# EAGLE design Emech_DevBoard_v2.0 (EAGLE 9.0.1)

## Sheet 1 of 2
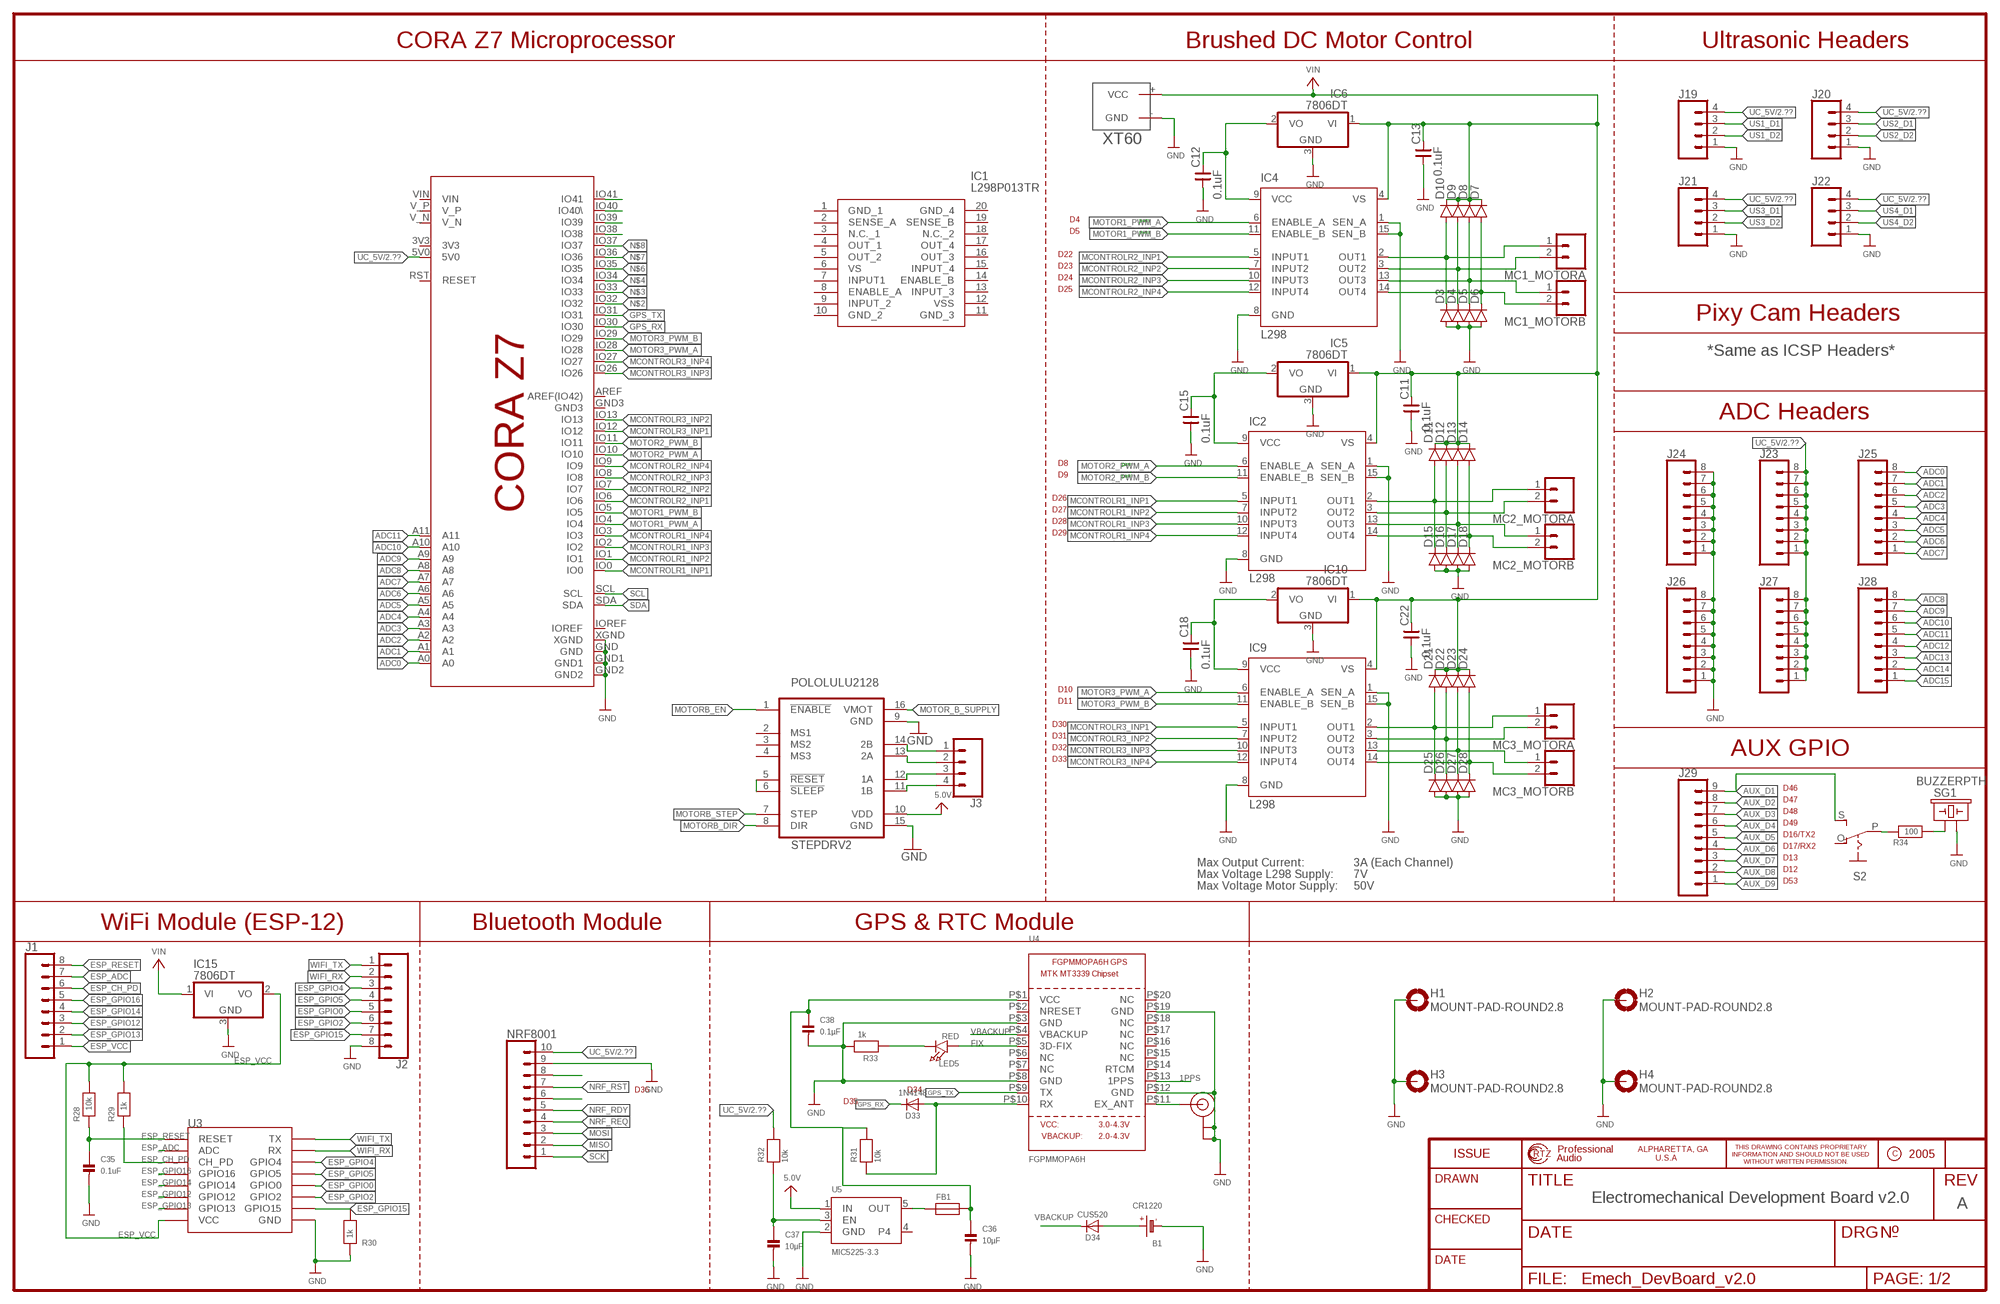
[diagram p0: schematic, sheet 1]

### Parts
B1  CR1220  BATTERYCR1220_SMT  [CR1220]
C11  0.1uF  CNP-0603  [0603]
C12  0.1uF  CNP-0603  [0603]
C13  0.1uF  CNP-0603  [0603]
C15  0.1uF  CNP-0603  [0603]
C18  0.1uF  CNP-0603  [0603]
C22  0.1uF  CNP-0603  [0603]
C35  0.1uF  CAP_CERAMIC0805  [0805]
C36  10µF  CAP_CERAMIC0603  [0603]
C37  10µF  CAP_CERAMIC0603  [0603]
C38  0.1µF  CAP_CERAMIC0603  [0603]
D3  SS24FSCT-ND  DIODEDO214AA  [DO-214AA]
D4  SS24FSCT-ND  DIODEDO214AA  [DO-214AA]
D5  SS24FSCT-ND  DIODEDO214AA  [DO-214AA]
D6  SS24FSCT-ND  DIODEDO214AA  [DO-214AA]
D7  SS24FSCT-ND  DIODEDO214AA  [DO-214AA]
D8  SS24FSCT-ND  DIODEDO214AA  [DO-214AA]
D9  SS24FSCT-ND  DIODEDO214AA  [DO-214AA]
D10  SS24FSCT-ND  DIODEDO214AA  [DO-214AA]
D11  SS24FSCT-ND  DIODEDO214AA  [DO-214AA]
D12  SS24FSCT-ND  DIODEDO214AA  [DO-214AA]
D13  SS24FSCT-ND  DIODEDO214AA  [DO-214AA]
D14  SS24FSCT-ND  DIODEDO214AA  [DO-214AA]
D15  SS24FSCT-ND  DIODEDO214AA  [DO-214AA]
D16  SS24FSCT-ND  DIODEDO214AA  [DO-214AA]
D17  SS24FSCT-ND  DIODEDO214AA  [DO-214AA]
D18  SS24FSCT-ND  DIODEDO214AA  [DO-214AA]
D21  SS24FSCT-ND  DIODEDO214AA  [DO-214AA]
D22  SS24FSCT-ND  DIODEDO214AA  [DO-214AA]
D23  SS24FSCT-ND  DIODEDO214AA  [DO-214AA]
D24  SS24FSCT-ND  DIODEDO214AA  [DO-214AA]
D25  SS24FSCT-ND  DIODEDO214AA  [DO-214AA]
D26  SS24FSCT-ND  DIODEDO214AA  [DO-214AA]
D27  SS24FSCT-ND  DIODEDO214AA  [DO-214AA]
D28  SS24FSCT-ND  DIODEDO214AA  [DO-214AA]
D33  1N4148  DIODESOD-323  [SOD-323]
D34  CUS520  DIODESOD-323  [SOD-323]
FB1  FERRITE  [0603]
H1  MOUNT-PAD-ROUND2.8  [2,8-PAD]
H2  MOUNT-PAD-ROUND2.8  [2,8-PAD]
H3  MOUNT-PAD-ROUND2.8  [2,8-PAD]
H4  MOUNT-PAD-ROUND2.8  [2,8-PAD]
IC1  L298P013TR  [SOIC127P1420X360-20N]
IC2  L298  [MULTIWATT-15]
IC4  L298  [MULTIWATT-15]
IC5  7806DT  [TO252]
IC6  7806DT  [TO252]
IC9  L298  [MULTIWATT-15]
IC10  7806DT  [TO252]
IC15  7806DT  [TO252]
J1  CONN_08"  [1X08]
J2  CONN_08"  [1X08]
J3  CONN_04JST-PTH-VERT  [JST-4-PTH-VERT]
J19  CONN_04  [1X04]
J20  CONN_04  [1X04]
J21  CONN_04  [1X04]
J22  CONN_04  [1X04]
J23  CONN_08"  [1X08]
J24  CONN_08"  [1X08]
J25  CONN_08"  [1X08]
J26  CONN_08"  [1X08]
J27  CONN_08"  [1X08]
J28  CONN_08"  [1X08]
J29  CONN_09  [1X09]
LED5  RED  LED0805  [CHIPLED_0805]
MC1_MOTORA  CONN_025MM  [SCREWTERMINAL-5MM-2]
MC1_MOTORB  CONN_025MM  [SCREWTERMINAL-5MM-2]
MC2_MOTORA  CONN_025MM  [SCREWTERMINAL-5MM-2]
MC2_MOTORB  CONN_025MM  [SCREWTERMINAL-5MM-2]
MC3_MOTORA  CONN_025MM  [SCREWTERMINAL-5MM-2]
MC3_MOTORB  CONN_025MM  [SCREWTERMINAL-5MM-2]
NRF8001  CONN_10"  [1X10]
R28  10k  RESISTOR0805  [0805]
R29  1k  RESISTOR0805  [0805]
R30  1k  RESISTOR0805  [0805]
R31  10k  RESISTOR0603  [0603]
R32  10k  RESISTOR0603  [0603]
R33  1k  RESISTOR0603  [0603]
R34  100  RESISTOR0805  [0805]
S2  EG1218S  [EG1218]
SG1  BUZZERPTH  [BUZZER-12MM]
STEPDRV2  POLOLULU2128  [POLOLULU2128]
U3  ESP12  [ESP12]
U4  FGPMMOPA6H  GPS_FGPMMOPA6H  [FGPMMOPA6H]
U5  MIC5225-3.3  VREG_SOT23-5  [SOT23-5]
U$1  CORA_Z7  [CORA_Z7_SHIELD]
U$14  XT60  [XT60]
U$55  U.FL  [U.FL]

### Nets
1PPS: U4.P$13(1PPS)
5.0V: STEPDRV2.10(VDD) U5.1(IN)
ADC0: J25.8 U$1.A0
ADC1: J25.7 U$1.A1
ADC2: J25.6 U$1.A2
ADC3: J25.5 U$1.A3
ADC4: J25.4 U$1.A4
ADC5: J25.3 U$1.A5
ADC6: J25.2 U$1.A6
ADC7: J25.1 U$1.A7
ADC8: J28.8 U$1.A8
ADC9: J28.7 U$1.A9
ADC10: J28.6 U$1.A10
ADC11: J28.5 U$1.A11
ADC12: J28.4
ADC13: J28.3
ADC14: J28.2
ADC15: J28.1
AUX_D1: J29.9 S2.S
AUX_D2: J29.8
AUX_D3: J29.7
AUX_D4: J29.6
AUX_D5: J29.5
AUX_D6: J29.4
AUX_D7: J29.3
AUX_D8: J29.2
AUX_D9: J29.1
D9: NRF8001.6
ESP_ADC: J1.7 U3.ADC
ESP_CH_PD: J1.6 R29.1 U3.CH_PD
ESP_GPIO0: J2.5 U3.GPIO0
ESP_GPIO2: J2.6 U3.GPIO2
ESP_GPIO4: J2.3 U3.GPIO4
ESP_GPIO5: J2.4 U3.GPIO5
ESP_GPIO12: J1.3 U3.GPIO12
ESP_GPIO13: J1.2 U3.GPIO13
ESP_GPIO14: J1.4 U3.GPIO14
ESP_GPIO15: J2.7 R30.2 U3.GPIO15
ESP_GPIO16: J1.5 U3.GPIO16
ESP_RESET: C35.1 J1.8 R28.1 U3.RESET
ESP_VCC: IC15.2(VO) J1.1 R28.2 R29.2 U3.VCC
FIX: LED5.A U4.P$5(3D-FIX)
GND [32mil]: B1.- C11.1 C12.1 C13.1 C15.1 C18.1 C22.1 C35.2 C36.2 C37.2 C38.2 D3.A D4.A D5.A D6.A D15.A D16.A D17.A D18.A D25.A D26.A D27.A D28.A H1.B2,8(MOUNT) H2.B2,8(MOUNT) H3.B2,8(MOUNT) H4.B2,8(MOUNT) IC2.1(SEN_A) IC2.8(GND) IC2.15(SEN_B) IC4.1(SEN_A) IC4.8(GND) IC4.15(SEN_B) IC5.3(GND) IC6.3(GND) IC9.1(SEN_A) IC9.8(GND) IC9.15(SEN_B) IC10.3(GND) IC15.3(GND) J2.8 J19.1 J20.1 J21.1 J22.1 J24.1 J24.2 J24.3 J24.4 J24.5 J24.6 J24.7 J24.8 J26.1 J26.2 J26.3 J26.4 J26.5 J26.6 J26.7 J26.8 NRF8001.9 R30.1 R33.2 SG1.- STEPDRV2.9(GND) STEPDRV2.15(GND) U3.GND U4.P$3(GND) U4.P$8(GND) U4.P$12(GND) U4.P$19(GND) U5.2(GND) U$1.GND U$1.GND1 U$1.GND2 U$1.XGND U$14.-(GND) U$55.P$1(GND) U$55.P$2(GND) ; also sheet 2
GPS_RX: D33.C U$1.IO30
GPS_TX: U4.P$9(TX) U$1.IO31
MCONTROLR1_INP1: IC2.5(INPUT1) U$1.IO0
MCONTROLR1_INP2: IC2.7(INPUT2) U$1.IO1
MCONTROLR1_INP3: IC2.10(INPUT3) U$1.IO2
MCONTROLR1_INP4: IC2.12(INPUT4) U$1.IO3
MCONTROLR2_INP1: IC4.5(INPUT1) U$1.IO6
MCONTROLR2_INP2: IC4.7(INPUT2) U$1.IO7
MCONTROLR2_INP3: IC4.10(INPUT3) U$1.IO8
MCONTROLR2_INP4: IC4.12(INPUT4) U$1.IO9
MCONTROLR3_INP1: IC9.5(INPUT1) U$1.IO12
MCONTROLR3_INP2: IC9.7(INPUT2) U$1.IO13
MCONTROLR3_INP3: IC9.10(INPUT3) U$1.IO26
MCONTROLR3_INP4: IC9.12(INPUT4) U$1.IO27
MISO: NRF8001.2
MOSI: NRF8001.3
MOTOR1_PWM_A: IC4.6(ENABLE_A) U$1.IO4
MOTOR1_PWM_B: IC4.11(ENABLE_B) U$1.IO5
MOTOR2_PWM_A: IC2.6(ENABLE_A) U$1.IO10
MOTOR2_PWM_B: IC2.11(ENABLE_B) U$1.IO11
MOTOR3_PWM_A: IC9.6(ENABLE_A) U$1.IO28
MOTOR3_PWM_B: IC9.11(ENABLE_B) U$1.IO29
MOTOR_B_SUPPLY: STEPDRV2.16(VMOT)
MOTORB_DIR: STEPDRV2.8(DIR)
MOTORB_EN: STEPDRV2.1(!ENABLE)
MOTORB_STEP: STEPDRV2.7(STEP)
N$1: J3.1 STEPDRV2.14(2B)
N$2: U$1.IO32
N$3: U$1.IO33
N$4: U$1.IO34
N$5: J3.2 STEPDRV2.13(2A)
N$6: U$1.IO35
N$7: U$1.IO36
N$8: U$1.IO37
N$9: U$1.IO38
N$10: U$1.IO39
N$11: U$1.IO40(IO40\)
N$12: U$1.IO41
N$13: J3.3 STEPDRV2.12(1A)
N$14: J3.4 STEPDRV2.11(1B)
N$15: C12.2 IC4.9(VCC) IC6.2(VO)
N$17: C15.2 IC2.9(VCC) IC5.2(VO)
N$18: STEPDRV2.5(!RESET) STEPDRV2.6(!SLEEP)
N$33: D3.C D10.A IC4.2(OUT1) MC1_MOTORA.1
N$34: D4.C D9.A IC4.3(OUT2) MC1_MOTORA.2
N$35: D5.C D8.A IC4.13(OUT3) MC1_MOTORB.1
N$36: D6.C D7.A IC4.14(OUT4) MC1_MOTORB.2
N$38: D21.A D25.C IC9.2(OUT1) MC3_MOTORA.1
N$39: D22.A D26.C IC9.3(OUT2) MC3_MOTORA.2
N$40: D23.A D27.C IC9.13(OUT3) MC3_MOTORB.1
N$41: D24.A D28.C IC9.14(OUT4) MC3_MOTORB.2
N$42: C18.2 IC9.9(VCC) IC10.2(VO)
N$46: D11.A D15.C IC2.2(OUT1) MC2_MOTORA.1
N$47: D12.A D16.C IC2.3(OUT2) MC2_MOTORA.2
N$48: D13.A D17.C IC2.13(OUT3) MC2_MOTORB.1
N$49: D14.A D18.C IC2.14(OUT4) MC2_MOTORB.2
N$73: U4.P$11(EX_ANT) U$55.P$3(SIGNAL)
N$75: D33.A R31.1 U4.P$10(RX)
N$76: NRF8001.8
N$77: C36.1 C38.1 FB1.2 R31.2 U4.P$1(VCC)
N$78: C37.1 R32.1 U5.3(EN)
N$79: LED5.C R33.1
N$80: B1.+$1(+) B1.+$2(+) D34.A
N$81: R34.2 S2.P
N$82: R34.1 SG1.+
NRF_RDY: NRF8001.5
NRF_REQ: NRF8001.4
NRF_RST: NRF8001.7
OUT: FB1.1 U5.5(OUT)
SCK: NRF8001.1
SCL: U$1.SCL ; also sheet 2
SDA: U$1.SDA ; also sheet 2
UC_5V [16mil]: J19.4 J20.4 J21.4 J22.4 J23.1 J23.2 J23.3 J23.4 J23.5 J23.6 J23.7 J23.8 J27.1 J27.2 J27.3 J27.4 J27.5 J27.6 J27.7 J27.8 NRF8001.10 R32.2 U$1.5V0 ; also sheet 2
US1_D1: J19.3
US1_D2: J19.2
US2_D1: J20.3
US2_D2: J20.2
US3_D1: J21.3
US3_D2: J21.2
US4_D1: J22.3
US4_D2: J22.2
VBACKUP: D34.C U4.P$4(VBACKUP)
VIN [24mil]: C11.2 C13.2 C22.2 D7.C D8.C D9.C D10.C D11.C D12.C D13.C D14.C D21.C D22.C D23.C D24.C IC2.4(VS) IC4.4(VS) IC5.1(VI) IC6.1(VI) IC9.4(VS) IC10.1(VI) IC15.1(VI) U$14.+(VCC) ; also sheet 2
WIFI_RX: J2.2 U3.RX
WIFI_TX: J2.1 U3.TX
Unconnected: IC1.1(GND_1) IC1.2(SENSE_A) IC1.3(N.C._1) IC1.4(OUT_1) IC1.5(OUT_2) IC1.6(VS) IC1.7(INPUT1) IC1.8(ENABLE_A) IC1.9(INPUT_2) IC1.10(GND_2) IC1.11(GND_3) IC1.12(VSS) IC1.13(INPUT_3) IC1.14(ENABLE_B) IC1.15(INPUT_4) IC1.16(OUT_3) IC1.17(OUT_4) IC1.18(N.C._2) IC1.19(SENSE_B) IC1.20(GND_4) S2.O STEPDRV2.2(MS1) STEPDRV2.3(MS2) STEPDRV2.4(MS3) U4.P$2(NRESET) U4.P$6(NC) U4.P$7(NC) U4.P$14(RTCM) U4.P$15(NC) U4.P$16(NC) U4.P$17(NC) U4.P$18(NC) U4.P$20(NC) U5.4 U$1.3V3 U$1.AREF(AREF(IO42)) U$1.GND3 U$1.IOREF U$1.RST(RESET) U$1.V_N U$1.V_P U$1.VIN

### Notes on the sheet
- CORA Z7 Microprocessor | Brushed DC Motor Control | Ultrasonic Headers
- D4 | pwm
- D5 | pwm
- D22
- D23
- D24
- D25
- Pixy Cam Headers
- *Same as ICSP Headers*
- ADC Headers
- D8 | pwm
- D9 | pwm
- D26
- D27
- D28
- D29
- D10
- D11
- D30
- D31
- D32
- AUX GPIO
- D33
- D46
- D47
- D48
- D49
- D16/TX2
- D17/RX2
- D13
- Max Output Current: | 3A | (Each Channel)
- D12
- Max Voltage L298 Supply: | 7V
- D53
- Max Voltage Motor Supply: | 50V
- WiFi Module (ESP-12) | Bluetooth Module | GPS & RTC Module
- D36 | D34
- D35
- Electromechanical Development Board v2.0
- A

## Sheet 2 of 2
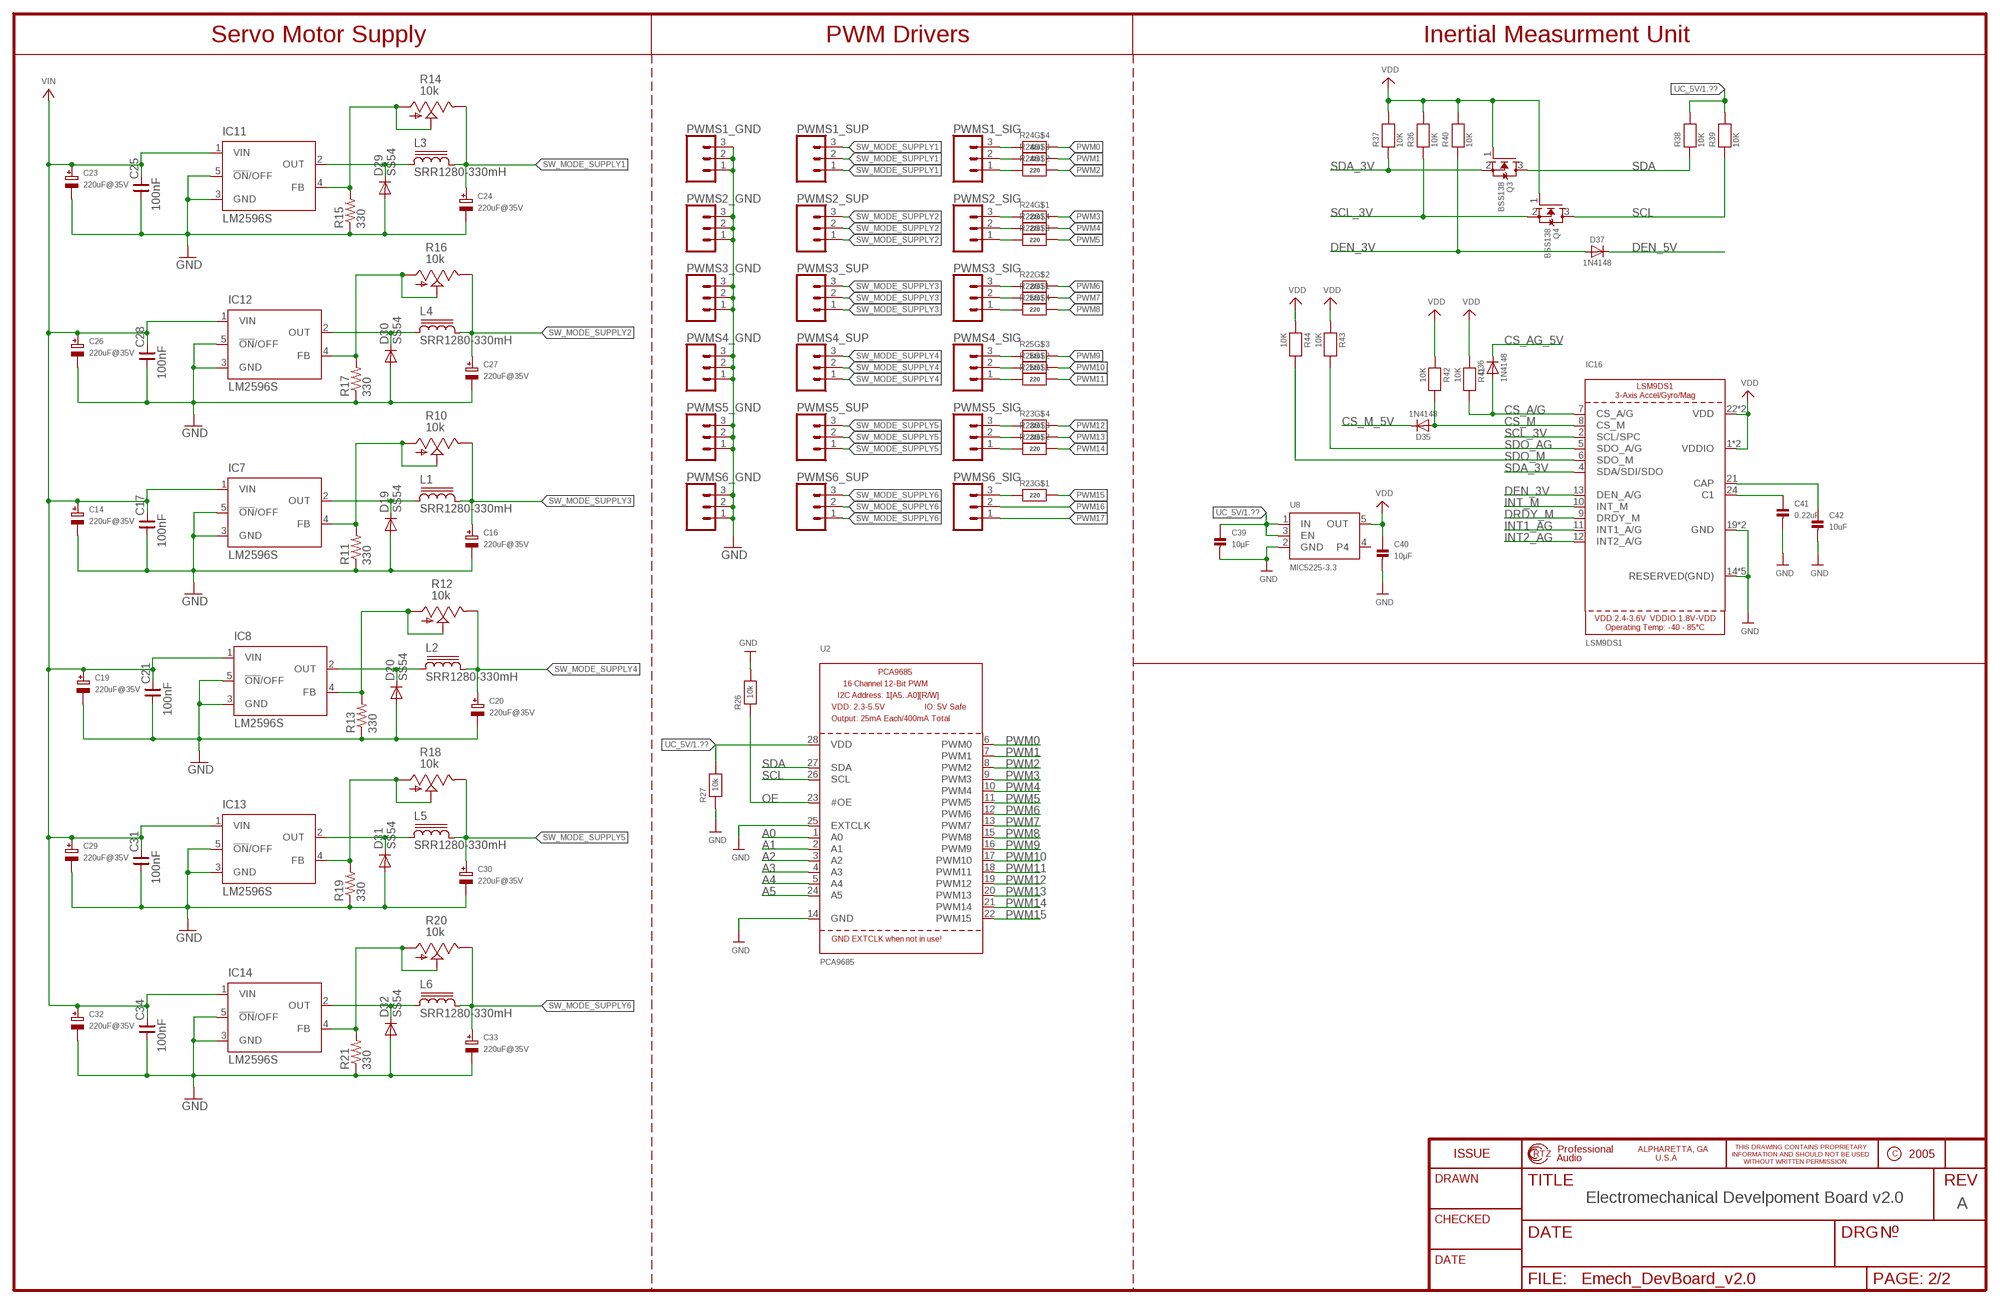
[diagram p1: schematic, sheet 2]

### Parts
C14  220uF@35V  CAP_ELECTROLYTICPANASONIC_D  [PANASONIC_D]
C16  220uF@35V  CAP_ELECTROLYTICPANASONIC_D  [PANASONIC_D]
C17  100nF  CNP-0603  [0603]
C19  220uF@35V  CAP_ELECTROLYTICPANASONIC_D  [PANASONIC_D]
C20  220uF@35V  CAP_ELECTROLYTICPANASONIC_D  [PANASONIC_D]
C21  100nF  CNP-0603  [0603]
C23  220uF@35V  CAP_ELECTROLYTICPANASONIC_D  [PANASONIC_D]
C24  220uF@35V  CAP_ELECTROLYTICPANASONIC_D  [PANASONIC_D]
C25  100nF  CNP-0603  [0603]
C26  220uF@35V  CAP_ELECTROLYTICPANASONIC_D  [PANASONIC_D]
C27  220uF@35V  CAP_ELECTROLYTICPANASONIC_D  [PANASONIC_D]
C28  100nF  CNP-0603  [0603]
C29  220uF@35V  CAP_ELECTROLYTICPANASONIC_D  [PANASONIC_D]
C30  220uF@35V  CAP_ELECTROLYTICPANASONIC_D  [PANASONIC_D]
C31  100nF  CNP-0603  [0603]
C32  220uF@35V  CAP_ELECTROLYTICPANASONIC_D  [PANASONIC_D]
C33  220uF@35V  CAP_ELECTROLYTICPANASONIC_D  [PANASONIC_D]
C34  100nF  CNP-0603  [0603]
C39  10µF  CAP_CERAMIC0603  [0603]
C40  10µF  CAP_CERAMIC0603  [0603]
C41  0.22uF  CAP_CERAMIC0603  [0603]
C42  10uF  CAP_CERAMIC0603  [0603]
D19  SS54  S3G  [DO214AB]
D20  SS54  S3G  [DO214AB]
D29  SS54  S3G  [DO214AB]
D30  SS54  S3G  [DO214AB]
D31  SS54  S3G  [DO214AB]
D32  SS54  S3G  [DO214AB]
D35  1N4148  DIODESOD-323  [SOD-323]
D36  1N4148  DIODESOD-323  [SOD-323]
D37  1N4148  DIODESOD-323  [SOD-323]
IC7  LM2596S  [TO263-5]
IC8  LM2596S  [TO263-5]
IC11  LM2596S  [TO263-5]
IC12  LM2596S  [TO263-5]
IC13  LM2596S  [TO263-5]
IC14  LM2596S  [TO263-5]
IC16  LSM9DS1  [LGA24_3.5X3.1MM]
L1  SRR1280-330mH  SRR1280  [SRR1280]
L2  SRR1280-330mH  SRR1280  [SRR1280]
L3  SRR1280-330mH  SRR1280  [SRR1280]
L4  SRR1280-330mH  SRR1280  [SRR1280]
L5  SRR1280-330mH  SRR1280  [SRR1280]
L6  SRR1280-330mH  SRR1280  [SRR1280]
PWMS1_GND  CONN_03  [1X03]
PWMS1_SIG  CONN_03  [1X03]
PWMS1_SUP  CONN_03  [1X03]
PWMS2_GND  CONN_03  [1X03]
PWMS2_SIG  CONN_03  [1X03]
PWMS2_SUP  CONN_03  [1X03]
PWMS3_GND  CONN_03  [1X03]
PWMS3_SIG  CONN_03  [1X03]
PWMS3_SUP  CONN_03  [1X03]
PWMS4_GND  CONN_03  [1X03]
PWMS4_SIG  CONN_03  [1X03]
PWMS4_SUP  CONN_03  [1X03]
PWMS5_GND  CONN_03  [1X03]
PWMS5_SIG  CONN_03  [1X03]
PWMS5_SUP  CONN_03  [1X03]
PWMS6_GND  CONN_03  [1X03]
PWMS6_SIG  CONN_03  [1X03]
PWMS6_SUP  CONN_03  [1X03]
Q3  BSS138  MOSFET-NWIDE  [SOT23-WIDE]
Q4  BSS138  MOSFET-NWIDE  [SOT23-WIDE]
R10  10k  TRIM_US-S64W  [S64W]
R11  330  R-US_R0603  [R0603]
R12  10k  TRIM_US-S64W  [S64W]
R13  330  R-US_R0603  [R0603]
R14  10k  TRIM_US-S64W  [S64W]
R15  330  R-US_R0603  [R0603]
R16  10k  TRIM_US-S64W  [S64W]
R17  330  R-US_R0603  [R0603]
R18  10k  TRIM_US-S64W  [S64W]
R19  330  R-US_R0603  [R0603]
R20  10k  TRIM_US-S64W  [S64W]
R21  330  R-US_R0603  [R0603]
R22  220  RESISTOR_4PACK  [RESPACK_4X0603]
R23  220  RESISTOR_4PACK  [RESPACK_4X0603]
R24  220  RESISTOR_4PACK  [RESPACK_4X0603]
R25  220  RESISTOR_4PACK  [RESPACK_4X0603]
R26  10k  RESISTOR0805  [0805]
R27  10k  RESISTOR0805  [0805]
R36  10K  RESISTOR0603  [0603]
R37  10K  RESISTOR0603  [0603]
R38  10K  RESISTOR0603  [0603]
R39  10K  RESISTOR0603  [0603]
R40  10K  RESISTOR0603  [0603]
R41  10K  RESISTOR0603  [0603]
R42  10K  RESISTOR0603  [0603]
R43  10K  RESISTOR0603  [0603]
R44  10K  RESISTOR0603  [0603]
U2  PCA9685  [TSSOP28]
U8  MIC5225-3.3  VREG_SOT23-5  [SOT23-5]

### Nets
A0: U2.1(A0)
A1: U2.2(A1)
A2: U2.3(A2)
A3: U2.4(A3)
A4: U2.5(A4)
A5: U2.24(A5)
C2: C41.1 IC16.24(C1)
CAP1: C42.1 IC16.21(CAP)
CS_A/G: D36.A IC16.7(CS_A/G) R41.2
CS_AG_5V: D36.C
CS_M: D35.A IC16.8(CS_M) R42.2
CS_M_5V: D35.C
DEN_3V: D37.A IC16.13(DEN_A/G) R40.1
DEN_5V: D37.C
DRDY_M: IC16.9(DRDY_M)
GND [32mil]: C14.- C16.- C17.1 C19.- C20.- C21.1 C23.- C24.- C25.1 C26.- C27.- C28.1 C29.- C30.- C31.1 C32.- C33.- C34.1 C39.2 C40.2 C41.2 C42.2 D19.A D20.A D29.A D30.A D31.A D32.A IC7.3(GND) IC7.5(!ON!/OFF) IC8.3(GND) IC8.5(!ON!/OFF) IC11.3(GND) IC11.5(!ON!/OFF) IC12.3(GND) IC12.5(!ON!/OFF) IC13.3(GND) IC13.5(!ON!/OFF) IC14.3(GND) IC14.5(!ON!/OFF) IC16.14(RESERVED(GND)) IC16.15(RESERVED(GND)) IC16.16(RESERVED(GND)) IC16.17(RESERVED(GND)) IC16.18(RESERVED(GND)) IC16.19(GND) IC16.20(GND) PWMS1_GND.1 PWMS1_GND.2 PWMS1_GND.3 PWMS2_GND.1 PWMS2_GND.2 PWMS2_GND.3 PWMS3_GND.1 PWMS3_GND.2 PWMS3_GND.3 PWMS4_GND.1 PWMS4_GND.2 PWMS4_GND.3 PWMS5_GND.1 PWMS5_GND.2 PWMS5_GND.3 PWMS6_GND.1 PWMS6_GND.2 PWMS6_GND.3 R11.1 R13.1 R15.1 R17.1 R19.1 R21.1 R26.2 R27.1 U2.14(GND) U2.25(EXTCLK) U8.2(GND) ; also sheet 1
INT1_AG: IC16.11(INT1_A/G)
INT2_AG: IC16.12(INT2_A/G)
INT_M: IC16.10(INT_M)
N$16: D19.C IC7.2(OUT) L1.1
N$27: IC7.4(FB) R10.A R10.S R11.2
N$32: D20.C IC8.2(OUT) L2.1
N$37: IC8.4(FB) R12.A R12.S R13.2
N$43: D29.C IC11.2(OUT) L3.1
N$44: IC11.4(FB) R14.A R14.S R15.2
N$45: D30.C IC12.2(OUT) L4.1
N$50: IC12.4(FB) R16.A R16.S R17.2
N$51: D31.C IC13.2(OUT) L5.1
N$52: IC13.4(FB) R18.A R18.S R19.2
N$53: D32.C IC14.2(OUT) L6.1
N$54: IC14.4(FB) R20.A R20.S R21.2
N$55: PWMS1_SIG.3 R24.4
N$57: PWMS6_SIG.3 R23.1
N$58: PWMS5_SIG.1 R23.2
N$59: PWMS5_SIG.2 R23.3
N$60: PWMS5_SIG.3 R23.4
N$61: PWMS4_SIG.1 R25.1
N$62: PWMS4_SIG.2 R25.2
N$63: PWMS4_SIG.3 R25.3
N$64: PWMS3_SIG.1 R25.4
N$65: PWMS3_SIG.2 R22.1
N$66: PWMS3_SIG.3 R22.2
N$67: PWMS2_SIG.1 R22.3
N$68: PWMS2_SIG.2 R22.4
N$69: PWMS2_SIG.3 R24.1
N$70: PWMS1_SIG.2 R24.3
N$71: PWMS1_SIG.1 R24.2
OE: R26.1 U2.23(#OE)
PWM0: R24.5 U2.6(PWM0)
PWM1: R24.6 U2.7(PWM1)
PWM2: R24.7 U2.8(PWM2)
PWM3: R24.8 U2.9(PWM3)
PWM4: R22.5 U2.10(PWM4)
PWM5: R22.6 U2.11(PWM5)
PWM6: R22.7 U2.12(PWM6)
PWM7: R22.8 U2.13(PWM7)
PWM8: R25.5 U2.15(PWM8)
PWM9: R25.6 U2.16(PWM9)
PWM10: R25.7 U2.17(PWM10)
PWM11: R25.8 U2.18(PWM11)
PWM12: R23.5 U2.19(PWM12)
PWM13: R23.6 U2.20(PWM13)
PWM14: R23.7 U2.21(PWM14)
PWM15: R23.8 U2.22(PWM15)
PWM16: PWMS6_SIG.2
PWM17: PWMS6_SIG.1
SCL: Q4.3(D) R39.1 U2.26(SCL) ; also sheet 1
SCL_3V: IC16.2(SCL/SPC) Q4.2(S) R36.1
SDA: Q3.3(D) R38.1 U2.27(SDA) ; also sheet 1
SDA_3V: IC16.4(SDA/SDI/SDO) Q3.2(S) R37.1
SDO_AG: IC16.5(SDO_A/G) R43.2
SDO_M: IC16.6(SDO_M) R44.2
SW_MODE_SUPPLY1: C24.+ L3.2 PWMS1_SUP.1 PWMS1_SUP.2 PWMS1_SUP.3 R14.E
SW_MODE_SUPPLY2: C27.+ L4.2 PWMS2_SUP.1 PWMS2_SUP.2 PWMS2_SUP.3 R16.E
SW_MODE_SUPPLY3: C16.+ L1.2 PWMS3_SUP.1 PWMS3_SUP.2 PWMS3_SUP.3 R10.E
SW_MODE_SUPPLY4: C20.+ L2.2 PWMS4_SUP.1 PWMS4_SUP.2 PWMS4_SUP.3 R12.E
SW_MODE_SUPPLY5: C30.+ L5.2 PWMS5_SUP.1 PWMS5_SUP.2 PWMS5_SUP.3 R18.E
SW_MODE_SUPPLY6: C33.+ L6.2 PWMS6_SUP.1 PWMS6_SUP.2 PWMS6_SUP.3 R20.E
UC_5V [16mil]: C39.1 R27.2 R38.2 R39.2 U2.28(VDD) U8.1(IN) U8.3(EN) ; also sheet 1
VDD: C40.1 IC16.1(VDDIO) IC16.3(VDDIO) IC16.22(VDD) IC16.23(VDD) Q3.1(G) Q4.1(G) R36.2 R37.2 R40.2 R41.1 R42.1 R43.1 R44.1 U8.5(OUT)
VIN [24mil]: C14.+ C17.2 C19.+ C21.2 C23.+ C25.2 C26.+ C28.2 C29.+ C31.2 C32.+ C34.2 IC7.1(VIN) IC8.1(VIN) IC11.1(VIN) IC12.1(VIN) IC13.1(VIN) IC14.1(VIN) ; also sheet 1
Unconnected: U8.4

### Notes on the sheet
- Servo Motor Supply | PWM Drivers | Inertial Measurment Unit
- Electromechanical Develpoment Board v2.0
- A

## Library data of the parts
B1 = microbuilder:BATTERY: CR1220 SMT - Digikey: 3001K-ND CD2032 BAT-HLD-001 - Digikey: BAT-HLD-001-ND
C11-C13 C15 C17 C18 C21 C22 C25 C28 C31 C34 = cap-master:CNP-: NON-POLARIZED CAP
C14 C16 C19 C20 C23 C24 C26 C27 C29 C30 C32 C33 = microbuilder:CAP_ELECTROLYTIC: Electrolytic Capacitors PANASONIC_C - Size C Panasonic Electrolytic Aluminum Capacitor 47µF 16V 20% Electrolytic Capacitor [Digikey: PCE3890TR-ND] PANASONIC_D - Size D Panasonic Electrolytic Aluminum Capacitor 100µF 25V 20% Electrolytic Capacitor [Digikey: PCE3898TR-ND]
C35-C42 = microbuilder:CAP_CERAMIC: Ceramic Capacitors 0402 - 0402 Surface Mount Capacitors 16pF 50V 5% [Digikey: 445-4899-2-ND] 18pF 50V 5% [Digikey: 490-1281-2-ND] 22pF 50V 5% [Digikey: 490-1283-2-ND] 68pF 50V 5% [Digikey: 490-1289-2-ND] 0.1uF 10V 10% [Digikey: 490-1318-2-ND] 1.0uF 6.3V 10% [Digikey: 490-1320-2-ND] 0603 - 0603 Surface Mount Capacitors 16 pF 50V 5% [Digikey: 445-5051-2-ND] 22 pF 50V [Digikey: PCC220ACVTR-ND] 33 pF 50V 5% [Digikey: 490-1415-1-ND] 56pF 50V 5% [Digikey: 490-1421-1-ND] 220pF 50V 5% [Digikey: 445-1285-1-ND] 680 pF 50V 2200 pF 50V 5% C0G [Digikey: 445-1297-1-ND] 5600 pF 100V 5% X7R [Digikey: 478-3711-1-ND] 0.1 µF 25V 10% [Digikey: PCC2277TR-ND] 0.22 µF 16V 10% X7R [Digikey: 445-1318-1-ND] 1.0 µF 25V 10% [Digikey: 445-5146-2-ND] 0603 - RF Specific 3pF 250V +/-0.1pF RF [Digikey: 712-1347-1-ND] 18 pF 250V 5% [Digikey: 478-3505-1-ND or 712-1322-1-ND] 56 pF 250V 5% C0G RF [Digikey: 490-4867-1-ND] 68 pF 250V RF [Digikey: 490-4868-1-ND] 0805 - 0805 Surface Mount Capacitors 220 pF 250V 2% RF Ceramic Capacitor [Digikey: 712-1398-1-ND] 1000 pF 50V 2% NP0 Ceramic Capacitor [Digikey: 478-3760-1-ND] 0.1 µF 25V 10% Ceramic Capacitor [Digikey: PCC1828TR-ND] 1.0 µF 16V 10% Ceramic Capacitor[Digikey: 490-1691-2-ND] 10.0 µF 10V 10% Ceramic Capacitor[Digikey: 709-1228-1-ND] 10.0 uF 16V 10% Ceramic Capacitor [Digikey: 478-5165-2-ND] 47 uF 6.3V 20% Ceramic Capacitor [Digikey: 587-1779-1-ND or 399-5506-1-ND] 1206 - 1206 Surface Mount Capacitors 47uF 10V 20% Ceramic Capacitor [Digikey: 490-5528-1-ND or 399-5508-1-ND or 445-6010-1-ND]
D3-D18 D21-D28 = BeagleBone_Blue_R3:DIODE: Diode
D19 D20 D29-D32 = s3x_10:S3*: S3A - S3N General Purpose Rectifiers Source: http://www.fairchildsemi.com/datasheets/S3/S3A.pdf; MF: Fairchild; MPN: S3G; OC_FARNELL: 2454094; OC_NEWARK: 58K2397
D33-D37 = microbuilder:DIODE: Diode
FB1 = microbuilder:FERRITE: Ferrite Bead 0603 MMZ1608B121C - 120 Ohm, 600mA Ferrite Chip - Digikey: 445-2164-1-ND BK1608HW121-T - 120 Ohm, 600mA Ferrite Chip - Digikey: 587-1876-2-ND
H1-H4 = holes:MOUNT-PAD-ROUND: MOUNTING PAD, round
IC1 = L298P013TR:L298P013TR: Dual Full-Bridge Power Driver PowerSO20 STMicroelectronics L298P013TR Brushed DC Motor Driver IC, 46 V 4A, 20-Pin PowerSO Source: Datasheet <http://www.st.com/content/ccc/resource/technical/document/datasheet/82/cc/3f/39/0a/29/4d/f0/CD00000240.pdf/files/CD00000240.pdf/jcr:content/translations/en.CD00000240.pdf>; DESCRIPTION: Dual Full-Bridge Power Driver PowerSO20 STMicroelectronics L298P013TR Brushed DC Motor Driver IC, 46 V 4A, 20-Pin PowerSO; HEIGHT: 3.6mm; MANUFACTURER_NAME: STMicroelectronics; MANUFACTURER_PART_NUMBER: L298P013TR; MOUSER_PART_NUMBER: 511-L298P-TR; MOUSER_PRICE-STOCK: https://www.mouser.com/Search/Refine.aspx?Keyword=511-L298P-TR; RS_PART_NUMBER: 8805308P; RS_PRICE-STOCK: http://uk.rs-online.com/web/p/products/8805308P
IC2 IC4 IC9 = st-microelectronics:L298: DUAL FULL-BRIDGE DRIVER; MPN: L298N; OC_FARNELL: 1589425; OC_NEWARK: 32M1527
IC5 IC6 IC10 IC15 = adafruit:78*: Positive VOLTAGE REGULATOR Added bigger pads to the TO-92 package
IC7 IC8 IC11-IC14 = national-semiconductor:LM2596: SIMPLE SWITCHER® Power Converter 150 kHz 3A Step-Down Voltage Regulator Source: http://www.national.com/ds/LM/LM2596.pdf; MF: NATIONAL SEMICONDUCTOR; MPN: LM2596S-ADJ/NOPB; OC_FARNELL: 9494367; OC_NEWARK: 41K3842
IC16 = microbuilder:LSM9DS1
J1 J2 J23-J28 = SparkFun-Connectors:CONN_08: Multi connection point. Often used as Generic Header-pin footprint for 0.1 inch spaced/style header connections On any of the 0.1 inch spaced packages, you can populate with these: Break Away Headers - Straight <https://www.sparkfun.com/products/116> (PRT-00116) Break Away Male Headers - Right Angle <https://www.sparkfun.com/products/553> (PRT-00553) Female Headers <https://www.sparkfun.com/products/115> (PRT-00115) Break Away Headers - Machine Pin <https://www.sparkfun.com/products/117> (PRT-00117) Break Away Female Headers - Swiss Machine Pin <https://www.sparkfun.com/products/743> (PRT-00743) Arduino Stackable Header - 8 Pin <https://www.sparkfun.com/products/9279> (PRT-09279) For SCREWTERMINALS and SPRING TERMINALS visit here: Screw Terimnals on SparkFun.com <https://www.sparkfun.com/search/results?term=Screw+Terminals> (5mm/3.5mm/2.54mm spacing) This device is also useful as a general connection point to wire up your design to another part of your project. Our various solder wires solder well into these plated through hole pads. Hook-Up Wire - Assortment (Stranded, 22 AWG) <https://www.sparkfun.com/products/11375> (PRT-11375) Hook-Up Wire - Assortment (Solid Core, 22 AWG) <https://www.sparkfun.com/products/11367> (PRT-11367) View the entire wire category on our website here <https://www.sparkfun.com/categories/141> Special notes: Molex polarized connector foot print use with SKU : PRT-08231 with associated crimp pins and housings. 1MM SMD Version SKU: PRT-10208 NOTES ON THE VARIANTS LOCK and LOCK_LONGPADS... This footprint was designed to help hold the alignment of a through-hole component (i.e. 6-pin header) while soldering it into place. You may notice that each hole has been shifted either up or down by 0.005 of an inch from it's more standard position (which is a perfectly straight line). This slight alteration caused the pins (the squares in the middle) to touch the edges of the holes. Because they are alternating, it causes a "brace" to hold the component in place. 0.005 has proven to be the perfect amount of "off-center" position when using our standard breakaway headers. Although looks a little odd when you look at the bare footprint, once you have a header in there, the alteration is very hard to notice. Also,if you push a header all the way into place, it is covered up entirely on the bottom side.; PROD_ID: CONN-08438
J3 = SparkFun-Connectors:CONN_04: Multi connection point. Often used as Generic Header-pin footprint for 0.1 inch spaced/style header connections On any of the 0.1 inch spaced packages, you can populate with these: Break Away Headers - Straight <https://www.sparkfun.com/products/116> (PRT-00116) Break Away Male Headers - Right Angle <https://www.sparkfun.com/products/553> (PRT-00553) Female Headers <https://www.sparkfun.com/products/115> (PRT-00115) Break Away Headers - Machine Pin <https://www.sparkfun.com/products/117> (PRT-00117) Break Away Female Headers - Swiss Machine Pin <https://www.sparkfun.com/products/743> (PRT-00743) For SCREWTERMINALS and SPRING TERMINALS visit here: Screw Terimnals on SparkFun.com <https://www.sparkfun.com/search/results?term=Screw+Terminals> (5mm/3.5mm/2.54mm spacing) This device is also useful as a general connection point to wire up your design to another part of your project. Our various solder wires solder well into these plated through hole pads. Hook-Up Wire - Assortment (Stranded, 22 AWG) <https://www.sparkfun.com/products/11375> (PRT-11375) Hook-Up Wire - Assortment (Solid Core, 22 AWG) <https://www.sparkfun.com/products/11367> (PRT-11367) View the entire wire category on our website here <https://www.sparkfun.com/categories/141> Special notes: Molex polarized connector foot print use with SKU : PRT-08231 with associated crimp pins and housings. 1MM SMD Version SKU: PRT-10208; PROD_ID: CONN-13251
J19-J22 = SparkFun-Connectors:CONN_04: Multi connection point. Often used as Generic Header-pin footprint for 0.1 inch spaced/style header connections On any of the 0.1 inch spaced packages, you can populate with these: Break Away Headers - Straight <https://www.sparkfun.com/products/116> (PRT-00116) Break Away Male Headers - Right Angle <https://www.sparkfun.com/products/553> (PRT-00553) Female Headers <https://www.sparkfun.com/products/115> (PRT-00115) Break Away Headers - Machine Pin <https://www.sparkfun.com/products/117> (PRT-00117) Break Away Female Headers - Swiss Machine Pin <https://www.sparkfun.com/products/743> (PRT-00743) For SCREWTERMINALS and SPRING TERMINALS visit here: Screw Terimnals on SparkFun.com <https://www.sparkfun.com/search/results?term=Screw+Terminals> (5mm/3.5mm/2.54mm spacing) This device is also useful as a general connection point to wire up your design to another part of your project. Our various solder wires solder well into these plated through hole pads. Hook-Up Wire - Assortment (Stranded, 22 AWG) <https://www.sparkfun.com/products/11375> (PRT-11375) Hook-Up Wire - Assortment (Solid Core, 22 AWG) <https://www.sparkfun.com/products/11367> (PRT-11367) View the entire wire category on our website here <https://www.sparkfun.com/categories/141> Special notes: Molex polarized connector foot print use with SKU : PRT-08231 with associated crimp pins and housings. 1MM SMD Version SKU: PRT-10208; PROD_ID: CONN-09696
J29 = SparkFun-Connectors:CONN_09: Multi connection point. Often used as Generic Header-pin footprint for 0.1 inch spaced/style header connections On any of the 0.1 inch spaced packages, you can populate with these: Break Away Headers - Straight <https://www.sparkfun.com/products/116> (PRT-00116) Break Away Male Headers - Right Angle <https://www.sparkfun.com/products/553> (PRT-00553) Female Headers <https://www.sparkfun.com/products/115> (PRT-00115) Break Away Headers - Machine Pin <https://www.sparkfun.com/products/117> (PRT-00117) Break Away Female Headers - Swiss Machine Pin <https://www.sparkfun.com/products/743> (PRT-00743) For SCREWTERMINALS and SPRING TERMINALS visit here: Screw Terimnals on SparkFun.com <https://www.sparkfun.com/search/results?term=Screw+Terminals> (5mm/3.5mm/2.54mm spacing) This device is also useful as a general connection point to wire up your design to another part of your project. Our various solder wires solder well into these plated through hole pads. Hook-Up Wire - Assortment (Stranded, 22 AWG) <https://www.sparkfun.com/products/11375> (PRT-11375) Hook-Up Wire - Assortment (Solid Core, 22 AWG) <https://www.sparkfun.com/products/11367> (PRT-11367) View the entire wire category on our website here <https://www.sparkfun.com/categories/141> Special notes: Molex polarized connector foot print use with SKU : PRT-08231 with associated crimp pins and housings. 1MM SMD Version SKU: PRT-10208 NOTES ON THE VARIANTS LOCK and LOCK_LONGPADS... This footprint was designed to help hold the alignment of a through-hole component (i.e. 6-pin header) while soldering it into place. You may notice that each hole has been shifted either up or down by 0.005 of an inch from it's more standard position (which is a perfectly straight line). This slight alteration caused the pins (the squares in the middle) to touch the edges of the holes. Because they are alternating, it causes a "brace" to hold the component in place. 0.005 has proven to be the perfect amount of "off-center" position when using our standard breakaway headers. Although looks a little odd when you look at the bare footprint, once you have a header in there, the alteration is very hard to notice. Also,if you push a header all the way into place, it is covered up entirely on the bottom side.
L1-L6 = inductor-bourns:SRR1280: POWER INDUCTOR
LED5 = microbuilder:LED: LED 0603 - 0603 Surface Mount Package 2mA: Green LED - Low Power (3.9mcd, 2ma, 1.7Vf) - Digikey: 475-2709-2-ND Orange LED - Low Power (9.8mcd, 2ma, 1.8Vf) - Digikey: 475-1194-2-ND Red LED - Low Power (5mcd, 2ma, 1.8Vf) - Digikey: 475-1195-2-ND Yellow LED - Low Power (7mcd, 2ma, 1.8Vf) - Digikey: 475-1196-2-ND 5mA: Blue LED - Low Power (17mcd, 5ma, 2.9Vf) - Digikey: LNJ937W8CRACT-ND 0805 - 0805 Surface Mount Package 2mA: Red LED (8.8mcd, 2mA, 1.8Vf, Clear) - Low Power [Digikey: 475-2510-1-ND] Green LED (5mcd, 2mA, 1.8Vf, Clear) - Low Power [Digikey: 475-2730-1-ND] Yellow LED (11.3mcd, 2mA, 1.8Vf, Clear) - Low Power [Digikey: 475-2555-1-ND] 20mA: Red LED (104mcd, 20mA, Diffused) - LS R976 [Digikey: 475-1278-6-ND] Red LED (12mcd, 20mA, 2.0Vf, Clear) - APT2012EC [Digikey: 754-1128-1-ND] Green LED (15mcd, 20mA, 2.2Vf, Clear) - APT2012GC [Digikey: 754-1131-1-ND] Orange LED (160mcd, 20mA, 2.1Vf, Clear) - APT2012SECK [Digikey: 754-1130-1-ND] 1206 - 1206 Surface Mount Package Green LED (26mcd, 20mA, Diffused) - LG N971 [Digikey: 475-1407-6-ND] Red LED (15mcd, 20mA, Diffused) - LH N974 [Digikey: 475-1416-6-ND]
MC1_MOTORA MC1_MOTORB MC2_MOTORA MC2_MOTORB MC3_MOTORA MC3_MOTORB = SparkFun-Connectors:CONN_02: Multi connection point. Often used as Generic Header-pin footprint for 0.1 inch spaced/style header connections On any of the 0.1 inch spaced packages, you can populate with these: Break Away Headers - Straight <https://www.sparkfun.com/products/116> (PRT-00116) Break Away Male Headers - Right Angle <https://www.sparkfun.com/products/553> (PRT-00553) Female Headers <https://www.sparkfun.com/products/115> (PRT-00115) Break Away Headers - Machine Pin <https://www.sparkfun.com/products/117> (PRT-00117) Break Away Female Headers - Swiss Machine Pin <https://www.sparkfun.com/products/743> (PRT-00743) For SCREWTERMINALS and SPRING TERMINALS visit here: Screw Terimnals on SparkFun.com <https://www.sparkfun.com/search/results?term=Screw+Terminals> (5mm/3.5mm/2.54mm spacing) This device is also useful as a general connection point to wire up your design to another part of your project. Our various solder wires solder well into these plated through hole pads. Hook-Up Wire - Assortment (Stranded, 22 AWG) <https://www.sparkfun.com/products/11375> (PRT-11375) Hook-Up Wire - Assortment (Solid Core, 22 AWG) <https://www.sparkfun.com/products/11367> (PRT-11367) View the entire wire category on our website here <https://www.sparkfun.com/categories/141> Special notes: Molex polarized connector foot print use with: PRT-08233 with associated crimp pins and housings. 2.54_SCREWTERM for use with PRT-10571. 3.5mm Screw Terminal footprints for PRT-08084 5mm Screw Terminal footprints for use with PRT-08432; SF_SKU: PRT-08432
NRF8001 = SparkFun-Connectors:CONN_10: Multi connection point. Often used as Generic Header-pin footprint for 0.1 inch spaced/style header connections On any of the 0.1 inch spaced packages, you can populate with these: Break Away Headers - Straight <https://www.sparkfun.com/products/116> (PRT-00116) Break Away Male Headers - Right Angle <https://www.sparkfun.com/products/553> (PRT-00553) Female Headers <https://www.sparkfun.com/products/115> (PRT-00115) Break Away Headers - Machine Pin <https://www.sparkfun.com/products/117> (PRT-00117) Break Away Female Headers - Swiss Machine Pin <https://www.sparkfun.com/products/743> (PRT-00743) Arduino Stackable Header - 10 Pin <https://www.sparkfun.com/products/11376> (PRT-11376) For SCREWTERMINALS and SPRING TERMINALS visit here: Screw Terimnals on SparkFun.com <https://www.sparkfun.com/search/results?term=Screw+Terminals> (5mm/3.5mm/2.54mm spacing) This device is also useful as a general connection point to wire up your design to another part of your project. Our various solder wires solder well into these plated through hole pads. Hook-Up Wire - Assortment (Stranded, 22 AWG) <https://www.sparkfun.com/products/11375> (PRT-11375) Hook-Up Wire - Assortment (Solid Core, 22 AWG) <https://www.sparkfun.com/products/11367> (PRT-11367) View the entire wire category on our website here <https://www.sparkfun.com/categories/141> Special notes: Molex polarized connector foot print use with SKU : PRT-08231 with associated crimp pins and housings. 1MM SMD Version SKU: PRT-10208 NOTES ON THE VARIANTS LOCK and LOCK_LONGPADS... This footprint was designed to help hold the alignment of a through-hole component (i.e. 6-pin header) while soldering it into place. You may notice that each hole has been shifted either up or down by 0.005 of an inch from it's more standard position (which is a perfectly straight line). This slight alteration caused the pins (the squares in the middle) to touch the edges of the holes. Because they are alternating, it causes a "brace" to hold the component in place. 0.005 has proven to be the perfect amount of "off-center" position when using our standard breakaway headers. Although looks a little odd when you look at the bare footprint, once you have a header in there, the alteration is very hard to notice. Also,if you push a header all the way into place, it is covered up entirely on the bottom side.; PROD_ID: CONN-11563
PWMS1_GND PWMS1_SIG PWMS1_SUP PWMS2_GND PWMS2_SIG PWMS2_SUP PWMS3_GND PWMS3_SIG PWMS3_SUP PWMS4_GND PWMS4_SIG PWMS4_SUP PWMS5_GND PWMS5_SIG PWMS5_SUP PWMS6_GND PWMS6_SIG PWMS6_SUP = SparkFun-Connectors:CONN_03: Multi connection point. Often used as Generic Header-pin footprint for 0.1 inch spaced/style header connections On any of the 0.1 inch spaced packages, you can populate with these: Break Away Headers - Straight <https://www.sparkfun.com/products/116> (PRT-00116) Break Away Male Headers - Right Angle <https://www.sparkfun.com/products/553> (PRT-00553) Female Headers <https://www.sparkfun.com/products/115> (PRT-00115) Break Away Headers - Machine Pin <https://www.sparkfun.com/products/117> (PRT-00117) Break Away Female Headers - Swiss Machine Pin <https://www.sparkfun.com/products/743> (PRT-00743) Stackable Header - 3 Pin (Female, 0.1") <https://www.sparkfun.com/products/13875> (PRT-13875) For SCREWTERMINALS and SPRING TERMINALS visit here: Screw Terimnals on SparkFun.com <https://www.sparkfun.com/search/results?term=Screw+Terminals> (5mm/3.5mm/2.54mm spacing) This device is also useful as a general connection point to wire up your design to another part of your project. Our various solder wires solder well into these plated through hole pads. Hook-Up Wire - Assortment (Stranded, 22 AWG) <https://www.sparkfun.com/products/11375> (PRT-11375) Hook-Up Wire - Assortment (Solid Core, 22 AWG) <https://www.sparkfun.com/products/11367> (PRT-11367) View the entire wire category on our website here <https://www.sparkfun.com/categories/141> Special notes: Molex polarized connector foot print use with SKU : PRT-08232 with associated crimp pins and housings.
Q3 Q4 = microbuilder:MOSFET-N: N-Channel Mosfet LEGEND VDS: Voltage Drain-Source ID: Drain Current RDS(ON): Drain-Source On-State Resistance VGS(TH): Gate-Source Threshold Voltage CISS: Drain-Source Input Capacitance SOT-23 Name VDS ID RDS(ON) VGS(TH) CISS Order Number 2N7002E 60V 260mA 2.5 Ohm 2.5V @ 250uA 26.7pF @ 25V 2N7002ET1GOSTR-ND BSH103 30V 850mA 400 mOhm 400mV @ 1mA 83pF @ 24V BSH103,235-ND BSS138 60V 320mA 1.6 Ohm 1.5V @ 250uA 50pF @ 10V Mouser: 771-BSS138PW115 DMN2075U-7 20V 4.2A 38 mOhm 1V @ 250 uA 594.3pF @ 10V DMN2075U-7DICT-ND * BSS138 good choice for I2C level-shifting POWERPAK 1212-8 Name VDS ID RDS(ON) VGS(TH) CISS Order Number Si7308DN 60V 6A 58 mOhm 3V @ 250uA 665pF @ 15V SI7308DN-T1-E3CT-ND
R10 R12 R14 R16 R18 R20 = pot:TRIM_US-: POTENTIOMETER
R11 R13 R15 R17 R19 R21 = adafruit:R-US_: RESISTOR, American symbol
R22-R25 = microbuilder:RESISTOR_4PACK: Resistor Packs (4 resistors) 4 x 0603 10K 1/16W - Digikey: YC164J-10KCT-ND
R26-R34 R36-R44 = microbuilder:RESISTOR: Resistors 0402 - 0402 Surface Mount Package 22 Ohm 1% 1/16W [Digikey: 311-22.0LRTR-ND] 33 Ohm 5% 1/16W 1.0K 5% 1/16W 1.5K 5% 1/16W 2.0K 1% 1/16W 10.0K 1% 1/16W [Digikey: 311-10.0KLRTR-ND] 10.0K 5% 1/16W [Digikey: RMCF0402JT10K0TR-ND] 12.1K 1% 1/16W [Digikey: 311-22.0LRTR-ND] 100.0K 5% 1/16W 0603 - 0603 Surface Mount Package 0 Ohm 1/10 Watt 1% Resistor 15 Ohm 1/10 Watt 1% Resistor 33 Ohm 1/10 Watt 1% Resistor 49.9 Ohm 1/10 Watt 1% Resistor 100 Ohm 1/10 Watt 1% Resistor 150 Ohm 1/10 Watt 1% Resistor 240 Ohm 1/10 Watt 1% Resistor 390 Ohm 1/10 Watt 1% Resistor 560 Ohm 1/10 Watt 1% Resistor 680 Ohm 1/10 Watt 1% Resistor 750 Ohm 1/10 Watt 1% Resistor 1.0K Ohm 1/10 Watt 1% Resistor 1.5K Ohm 1/10 Watt 1% Resistor 2.0K Ohm 1/10 Watt 1% Resistor 2.2K Ohm 1/10 Watt 1% Resistor 3.3K Ohm 1/10 Watt 1% Resistor 4.7K Ohm 1/10 Watt 1% Resistor 10.0K Ohm 1/10 Watt 1% Resistor 12.0K Ohm 1/10 Watt 1% Resistor 12.1K Ohm 1/10 Watt 1% Resistor 20.0K Ohm 1/10 Watt 1% Resistor 33.0K Ohm 1/10 Watt 1% Resistor 100.0K Ohm 1/10 Watt 1% Resistor 0805 - 0805 Surface Mount Package 0 Ohm 1/8 Watt 1% Resistor 33 Ohm 1/8 Watt 1% Resistor 100 Ohm 1/8 Watt 1% Resistor 150 Ohm 1/8 Watt 1% Resistor 200 Ohm 1/8 Watt 1% Resistor 240 Ohm 1/8 Watt 1% Resistor 330 Ohm 1/8 Watt 1% Resistor 390 Ohm 1/8 Watt 1% Resistor 470 Ohm 1/8 Watt 1% Resistor 1.0K Ohm 1/8 Watt 1% Resistor 1.5K Ohm 1/8 Watt 1% Resistor 2.0K Ohm 1/8 Watt 1% Resistor 4.7K Ohm 1/8 Watt 1% Resistor 5.1K Ohm 1/8 Watt 1% Resistor 5.6K Ohm 1/8 Watt 1% Resistor 10.0K Ohm 1/8 Watt 1% Resistor 22.0K Ohm 1/8 Watt 1% Resistor 33.0K Ohm 1/8 Watt 1% Resistor 100K Ohm 1/8 Watt 1% Resistor 1206 - 1206 Surface Mount Package 2012 - 2010 Surface Mount Package 0.11 Ohm 1/2 Watt 1% Resistor - Digikey: RHM.11UCT-ND
S2 = adafruit:EG1218: SLIDING SWITCH 0.1" spacing through hole, vertical SPDT slide switch http://www.ladyada.net/library/pcb/eaglelibrary.html
SG1 = SparkFun:BUZZER: Buzzer 12mm Spark Fun Electronics SKU : Comp-Buzzer
STEPDRV2 = stepper_drivers_etc:POLOLULU2128
U2 = microbuilder:PCA9685: PCA9685 - 16 Channel 12-Bit I2C PWM Controller 5.0V tolerant 16 channel, 12-bit I2C PWM controller with 25mA per output (max. 400mA total) Digikey: 568-5931-1-ND
U3 = esp8266modules:ESP12: ESP8266 Wifi module 12
U4 = microbuilder:GPS_FGPMMOPA6H: GPS Module - MTK MT3339 Chipset, -165dBm sensitivity, 22 channels, 10Hz, auto-select external antenna options
U5 U8 = microbuilder:VREG_SOT23-5: SOT23-5 Fixed Voltage Regulators Part Current Out V Out V In V Dropout θJA (°C/W) TJ (°C) Digikey Part No. ADP121 150mA 3.3V 3.4-5.5V 0.09V @ 150mA -- -- ADP121-AUJZ33R7CT-ND ADP121 150mA 3.0V 3.1-5.5V 0.09V @ 150mA -- -- ADP121-AUJZ30R7CT-ND ADP122 300mA 3.3V 3.4-5.5V 0.085V @ 300mA -- -- ADP122AUJZ-3.3-R7CT-ND ADP1712 300mA 3.3V 3.5-5.5V 0.17V @ 300mA -- -- ADP1712AUJZ-3.3-R7TR-ND AP7311 (Low Cost) 150mA 3.3V 3.5-6V 0.15V @ 150mA -- -- AP7311-33WG-7DICT-ND LD39015M18R 150mA 1.8V 1.9V-5.5V 0.08V @ 100mA -- -- 497-6977-1-ND LP2985A-33DBVR 150mA 3.3V 3.3-16V 0.28V @ 150mA 206 150 296-18479-1-ND MCP1824T-3302E/OT 300mA 3.3V 3.5V-6V 0.2V @ 300mA -- -- MCP1824T-3302E/OTCT-ND MIC5205-2.5YM5 TR 150mA 2.5V 2.7-16V 0.165V @ 150mA -- -- 576-1257-2-ND MIC5205-3.0YM5 TR 150mA 3.0V 3.2V-16V 0.165V @ 150mA -- -- 576-1258-2-ND MIC5205-3.3YM5 TR 150mA 3.3V 3.5V-16V 0.165V @ 150mA -- -- 576-1259-2-ND TPS780330220 150mA 3.3V+2.2V 3.6-5.5V 250mV Max -- -- 296-23332-1-ND TDA3663/N1,135 100mA 3.3V 3.5-45V 0.18V @ 50mA -- -- 568-5343-1-ND Max operating temp can be calculated using θJA, TJ (max junction temperature), and power in watts. Set the "Maximum Ambient Temperature" until it reaches TJ ("Max Junction Temperature"), which is the absolute limit for safe use of the regulator: Heat Sink Temperature Calculator <http://www.daycounter.com/Calculators/Heat-Sink-Temperature-Calculator.phtml> For example, With 12V source into a 3.3V LP2985 and a 30mA load, we are dissipating (12V-3.3V) * 0.03A = 0.261W. With a θJA of 206 °C/W, a TJ of 150°C, and 261mW we can safely use the chip without a heat sink up to 75°C (=147.1°C Junction Temperature).
U$1 = CORA_Z7:CORA_Z7: ZYNQ Processor 667MHz dual-core (*single-core) Cortex-A9 processor...... https://reference.digilentinc.com/reference/programmable-logic/cora-z7/reference-manual
U$14 = XT60:XT60: XT60
U$55 = microbuilder:U.FL: U.FL Antenna Connector

## Net classes
1 16mil: width 0.254 mm, drill 0.254 mm, clearance 0.127 mm
2 24mil: width 0.254 mm, drill 0.254 mm, clearance 0.127 mm
3 32mil: width 0.254 mm, drill 0.254 mm, clearance 0.127 mm

## Board
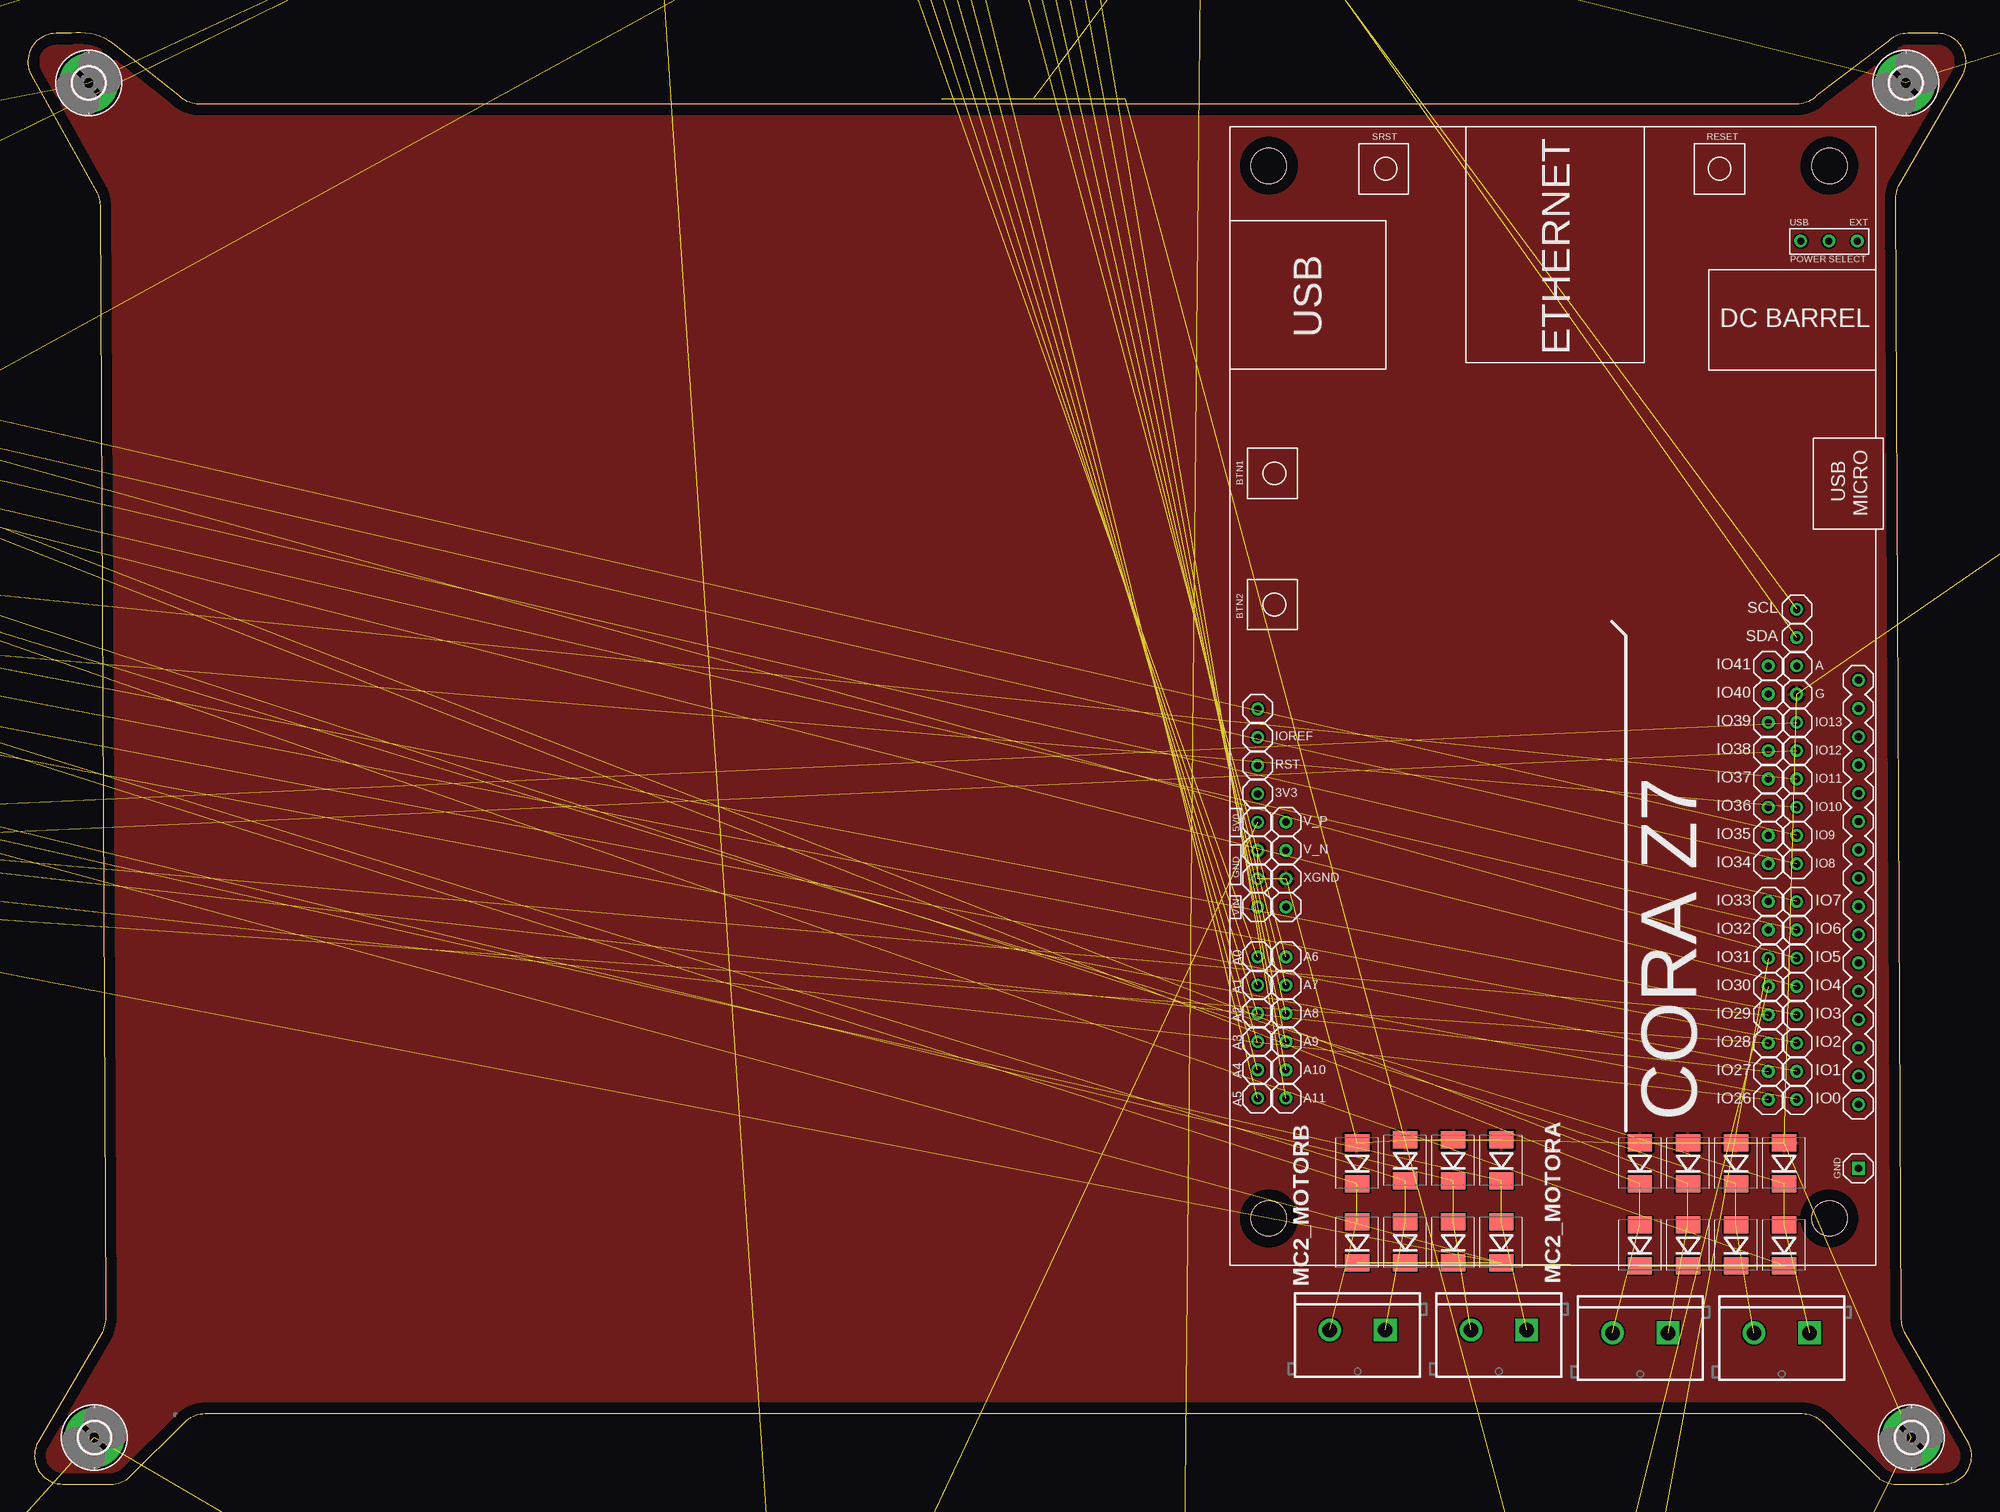
[diagram p2: board, top side]
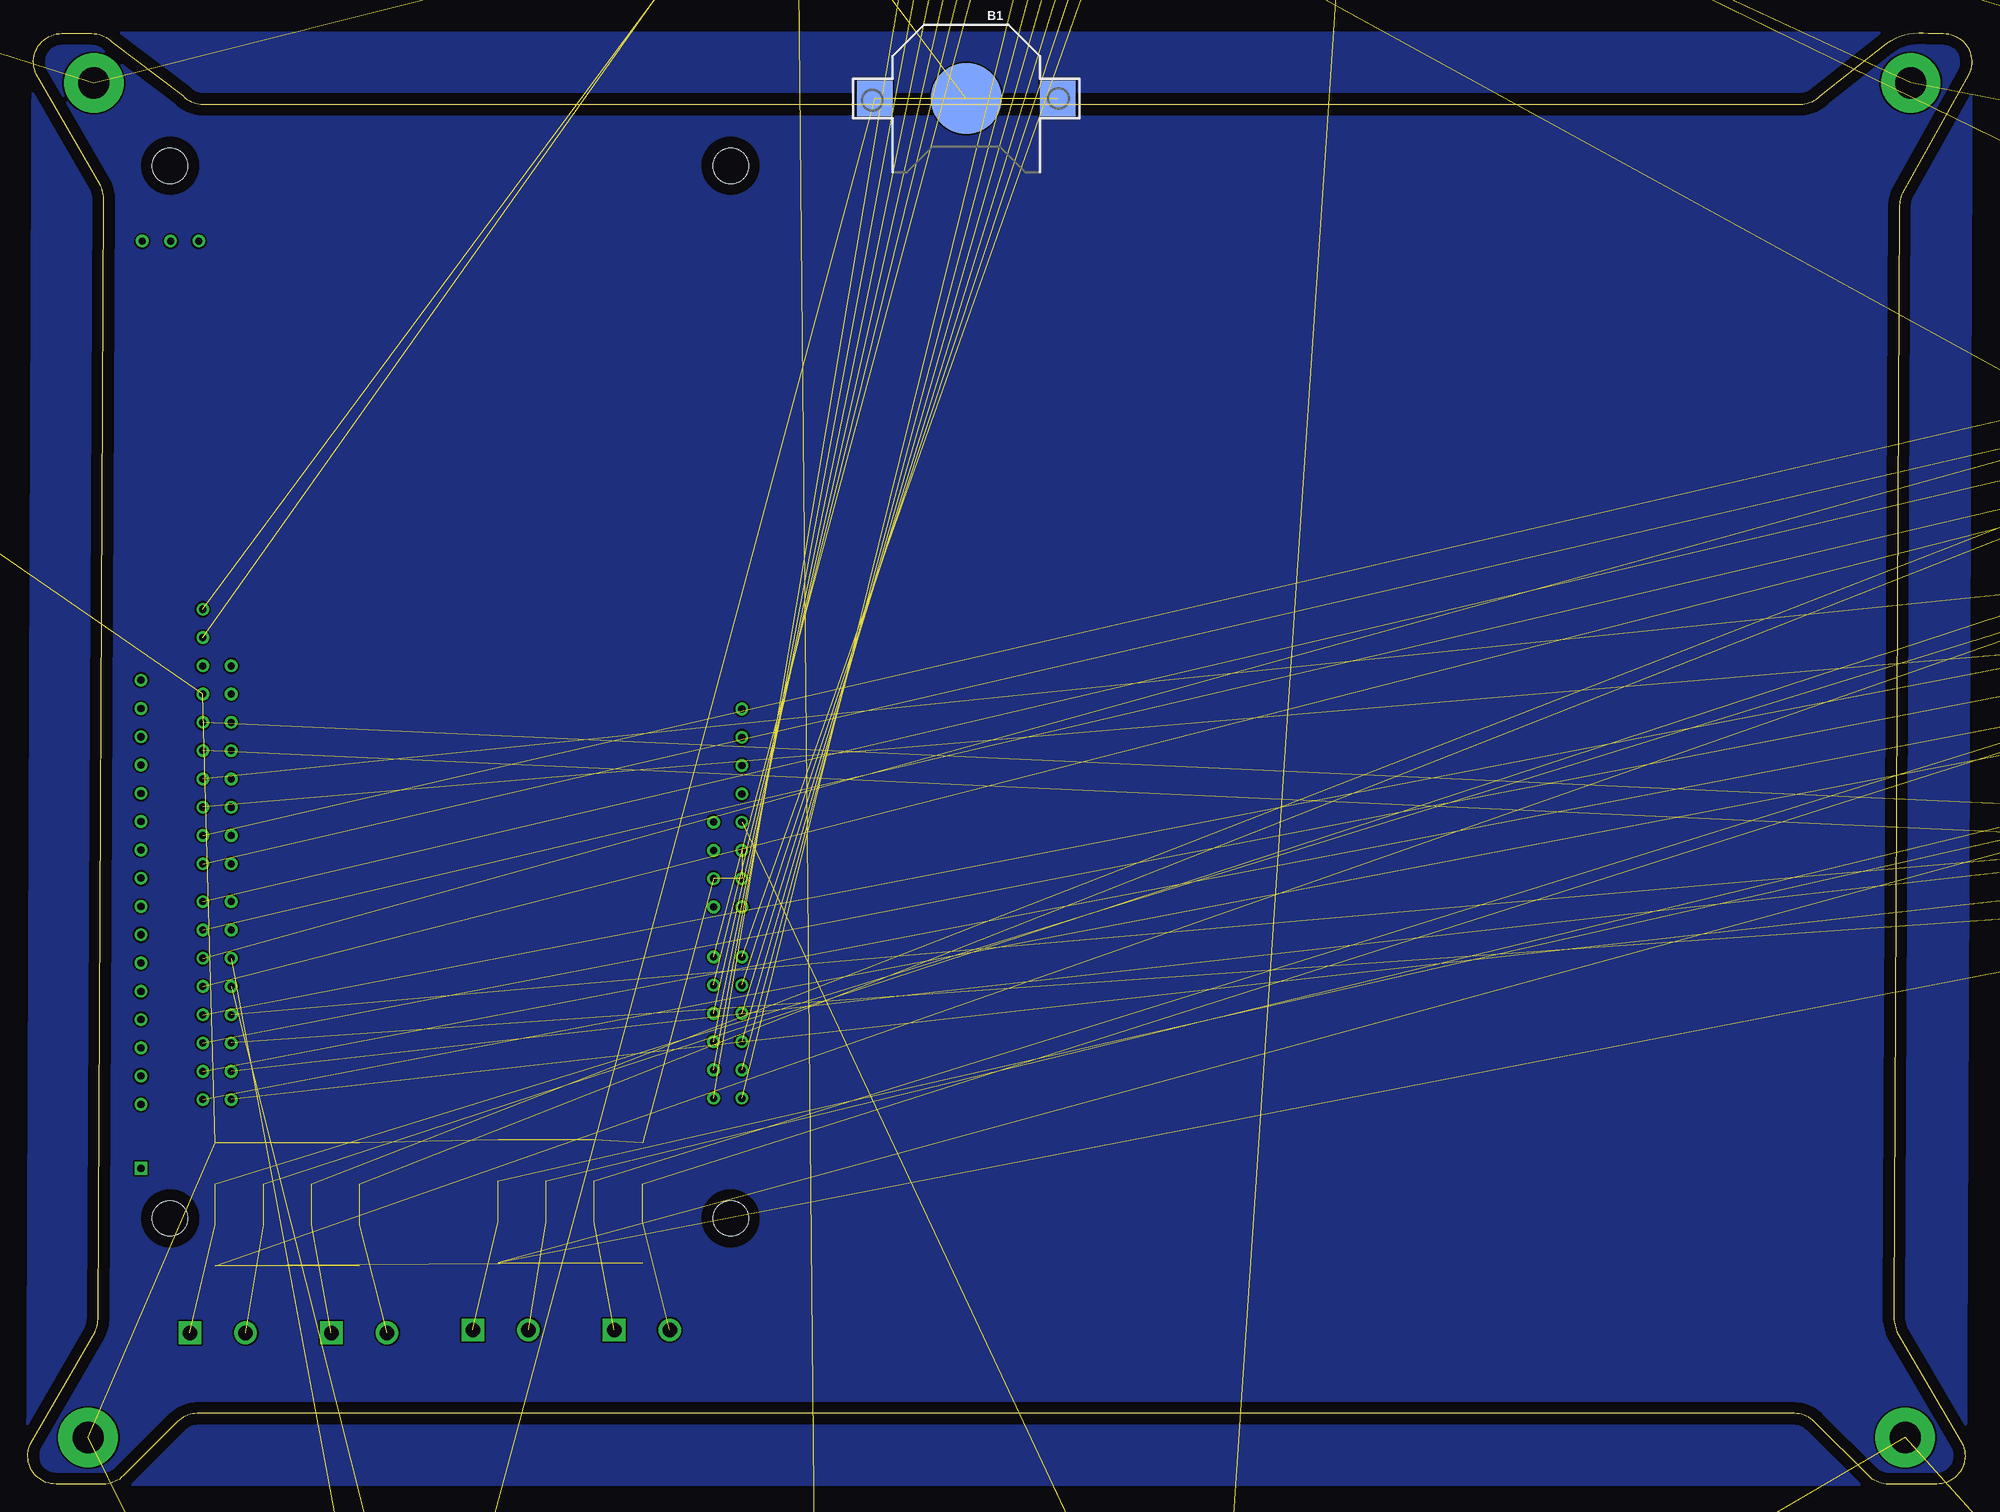
[diagram p3: board, bottom side, seen from below]

Size 174.58 x 130.37 mm. Coordinates in mm from the lower left corner, seen from the top.
Outline: 6.48,114.86 6.99,15.85 arc-27 6.71,13.68 0.87,3.69 arc117 3.14,0 7.46,0 arc45 9.26,0.74 14.12,5.61 arc-45 15.92,6.35 159.35,6.35 arc-45 161.15,5.61 166.01,0.74 arc45 167.81,0 172.04,0 arc117 174.32,3.68 168.55,13.69 arc-27 168.28,14.82 167.77,115.48 arc-27 168.04,116.61 173.81,126.63 arc117 171.54,130.3 168.82,130.3 arc45 167.03,129.56 160.64,124.7 arc-45 158.85,123.95 15.41,123.95 arc-45 13.61,124.7 7.61,129.43 arc45 3.91,130.3 2.54,130.3 arc116 0.25,126.65 6.23,115.97 arc-26 6.48,114.86
Copper layers (1*16): Top 0.035mm / dielectric 1.5mm / Bottom 0.035mm
Design rules "default *": minimum track width 6mil, minimum drill 0.35mm, track to track 6mil, track to pad 6mil, pad to pad 5mil, via to via 6mil, smd to smd 6mil, copper to edge 40mil, drill to drill 6mil, minimum pad ring 10mil, minimum via ring 8mil, stop-mask expansion 4mil, vias tented up to drill 0mil, thermal gap 10mil

### Footprints (pad centres in the part's own frame; a part is rotated, then mirrored left to right if it is on the bottom)
CR1220 = smd 3.2 x 3.2: +$1 -8.225,0; +$2 8.225,0 | smd 6.35 x 6.35: - 0,0
0603 = smd 1.016 x 1.016: 1 -0.953,0; 2 0.953,0
PANASONIC_D = smd 3.556 x 1.4: + 2.654,0; - -2.654,0
0805 = smd 1.3 x 1.5: 1 -0.95,0; 2 0.95,0
0603' = smd 1.1 x 1: 1 -0.85,0; 2 0.85,0
DO-214AA = smd 1.524 x 2.184: A 1.841,0; C -1.841,0
DO214AB = smd 2.5 x 3.3: A 3.4,0; C -3.4,0
SOD-323 = smd 1.35 x 0.8: A 1.27,0; C -1.27,0
2,8-PAD = drill 2.8 pad 5.334: B2,8 0,0
SOIC127P1420X360-20N = smd 2 x 0.7: 1 -6.6,5.715; 2 -6.6,4.445; 3 -6.6,3.175; 4 -6.6,1.905; 5 -6.6,0.635; 6 -6.6,-0.635; 7 -6.6,-1.905; 8 -6.6,-3.175; 9 -6.6,-4.445; 10 -6.6,-5.715; 11 6.6,-5.715; 12 6.6,-4.445; 13 6.6,-3.175; 14 6.6,-1.905; 15 6.6,-0.635; 16 6.6,0.635; 17 6.6,1.905; 18 6.6,3.175; 19 6.6,4.445; 20 6.6,5.715
MULTIWATT-15 = drill 1.2 long: 1 -8.89,-7.62; 2 -7.62,-2.54; 3 -6.35,-7.62; 4 -5.08,-2.54; 5 -3.81,-7.62; 6 -2.54,-2.54; 7 -1.27,-7.62; 8 0,-2.54; 9 1.27,-7.62; 10 2.54,-2.54; 11 3.81,-7.62; 12 5.08,-2.54; 13 6.35,-7.62; 14 7.62,-2.54; 15 8.89,-7.62
TO252 = smd 1 x 1.6: 1 -2.28,-4.8; 2 2.28,-4.8 | smd 5.4 x 6.2: 3 0,2.5
TO263-5 = smd 1.067 x 2.159: 1 -3.404,-5.791; 2 -1.702,-5.791; 3 0,-5.791; 4 1.702,-5.791; 5 3.404,-5.791 | smd 10.8 x 10.41: 6 0,2.54
LGA24_3.5X3.1MM = smd 0.23 x 0.35: 1 -1.505,1.22; 6 -1.505,-1.22; 7 -1.075,-1.22; 8 -0.645,-1.22; 9 -0.215,-1.22; 10 0.215,-1.22; 11 0.645,-1.22; 12 1.075,-1.22; 13 1.505,-1.22; 18 1.505,1.22; 19 1.075,1.22; 20 0.645,1.22; 21 0.215,1.22; 22 -0.215,1.22; 23 -0.645,1.22; 24 -1.075,1.22 | smd 0.35 x 0.23: 2 -1.475,0.645; 3 -1.475,0.215; 4 -1.475,-0.215; 5 -1.475,-0.645; 14 1.475,-0.645; 15 1.475,-0.215; 16 1.475,0.215; 17 1.475,0.645
1X08 = drill 1.016 pad 1.88: 1 0,0; 2 2.54,0; 3 5.08,0; 4 7.62,0; 5 10.16,0; 6 12.7,0; 7 15.24,0; 8 17.78,0
JST-4-PTH-VERT = drill 0.7 pad 1.6: 1 -3,-0.55; 2 -1,-0.55; 3 1,-0.55; 4 3,-0.55
1X04 = drill 1.016 pad 1.88: 1 0,0; 2 2.54,0; 3 5.08,0; 4 7.62,0
1X09 = drill 1.016 pad 1.88: 1 0,0; 2 2.54,0; 3 5.08,0; 4 7.62,0; 5 10.16,0; 6 12.7,0; 7 15.24,0; 8 17.78,0; 9 20.32,0
SRR1280 = smd 5.6 x 3.1: 1 0.635,5; 2 0.635,-5
CHIPLED_0805 = smd 1.2 x 1.2: A 0,-1.05; C 0,1.05
SCREWTERMINAL-5MM-2 = drill 1.3 pad 2.032 square: 1 0,0 | drill 1.3 pad 2.032: 2 5,0
1X10 = drill 1.016 pad 1.88: 1 0,0; 2 2.54,0; 3 5.08,0; 4 7.62,0; 5 10.16,0; 6 12.7,0; 7 15.24,0; 8 17.78,0; 9 20.32,0; 10 22.86,0
1X03 = drill 1.016 pad 1.88: 1 0,0; 2 2.54,0; 3 5.08,0
SOT23-WIDE = smd 1 x 1.2: 1 -0.95,-1; 2 0.95,-1; 3 0,1
S64W = drill 0.813 long: A 2.54,1.27; E -2.54,1.27; S 0,1.27
R0603 = smd 1 x 1.1: 1 -0.85,0; 2 0.85,0
RESPACK_4X0603 = smd 0.45 x 0.9: 1 -1.3,-0.85; 2 -0.4,-0.85; 3 0.4,-0.85; 4 1.3,-0.85; 5 1.3,0.85; 6 0.4,0.85; 7 -0.4,0.85; 8 -1.3,0.85
EG1218 = drill 0.9 pad 1.676: O -2.54,0; P 0,0; S 2.54,0
BUZZER-12MM = drill 0.9: + 3.25,0; - -3.25,0
POLOLULU2128 = drill 0.8 long: 1 -7.62,7.62; 2 -7.62,5.08; 3 -7.62,2.54; 4 -7.62,0; 5 -7.62,-2.54; 6 -7.62,-5.08; 7 -7.62,-7.62; 8 -7.62,-10.16; 9 5.08,-10.16; 10 5.08,-7.62; 11 5.08,-5.08; 12 5.08,-2.54; 13 5.08,0; 14 5.08,2.54; 15 5.08,5.08; 16 5.08,7.62
TSSOP28 = smd 0.305 x 0.991: 1 -4.225,-2.918; 2 -3.575,-2.918; 3 -2.925,-2.918; 4 -2.275,-2.918; 5 -1.625,-2.918; 6 -0.975,-2.918; 7 -0.325,-2.918; 8 0.325,-2.918; 9 0.975,-2.918; 10 1.625,-2.918; 11 2.275,-2.918; 12 2.925,-2.918; 13 3.575,-2.918; 14 4.225,-2.918; 15 4.225,2.918; 16 3.575,2.918; 17 2.925,2.918; 18 2.275,2.918; 19 1.625,2.918; 20 0.975,2.918; 21 0.325,2.918; 22 -0.325,2.918; 23 -0.975,2.918; 24 -1.625,2.918; 25 -2.275,2.918; 26 -2.925,2.918; 27 -3.575,2.918; 28 -4.225,2.918
ESP12 = drill 0.7 offset: ADC -7.1,3.8; CH_PD -7.1,1.8; GND 6.9,-8.2; GPIO0 6.9,-2.2; GPIO2 6.9,-4.2; GPIO4 6.9,1.8; GPIO5 6.9,-0.2; GPIO12 -7.1,-4.2; GPIO13 -7.1,-6.2; GPIO14 -7.1,-2.2; GPIO15 6.9,-6.2; GPIO16 -7.1,-0.2; RESET -7.1,5.8; RX 6.9,3.8; TX 6.9,5.8; VCC -7.1,-8.2
FGPMMOPA6H = smd 2 x 1: P$1 -8,6.75; P$2 -8,5.25; P$3 -8,3.75; P$4 -8,2.25; P$5 -8,0.75; P$6 -8,-0.75; P$7 -8,-2.25; P$8 -8,-3.75; P$9 -8,-5.25; P$10 -8,-6.75; P$11 8,-6.75; P$12 8,-5.25; P$13 8,-3.75; P$14 8,-2.25; P$15 8,-0.75; P$16 8,0.75; P$17 8,2.25; P$18 8,3.75; P$19 8,5.25; P$20 8,6.75 | hole 3: 0.2,0.8
SOT23-5 = smd 0.55 x 1.2: 1 -0.95,-1.3; 2 0,-1.3; 3 0.95,-1.3; 4 0.95,1.3; 5 -0.95,1.3
CORA_Z7_SHIELD = drill 0.635 pad 1.016: 3V3 59.92,2.5; 5V0 62.46,2.5; A0 74.56,2.5; A1 77.1,2.5; A2 79.64,2.5; A3 82.18,2.5; A4 84.72,2.5; A5 87.26,2.5; A6 74.56,5.04; A7 77.1,5.04; A8 79.64,5.04; A9 82.18,5.04; A10 84.72,5.04; A11 87.26,5.04; AREF 48.42,50.91; G0 49.71,56.47; G1 52.25,56.47; G3 57.33,56.47; G4 59.87,56.47; G5 62.41,56.47; G6 64.95,56.47; G7 67.49,56.47; G8 70.03,56.47; G9 72.57,56.47; G10 75.11,56.47; G11 77.65,56.47; G12 80.19,56.47; G13 82.73,56.47; G14 85.27,56.47; G15 87.81,56.47; G\2 54.79,56.47; GND 65,2.5; GND1 67.54,2.5; GND2 50.96,50.91; IO0 87.38,50.91; IO1 84.84,50.91; IO2 82.3,50.91; IO3 79.76,50.91; IO4 77.22,50.91; IO5 74.68,50.91; IO6 72.14,50.91; IO7 69.6,50.91; IO8 66.2,50.91; IO9 63.66,50.91; IO10 61.12,50.91; IO11 58.58,50.91; IO12 56.04,50.91; IO13 53.5,50.91; IO26 87.38,48.37; IO27 84.84,48.37; IO28 82.3,48.37; IO29 79.76,48.37; IO30 77.22,48.37; IO31 74.68,48.37; IO32 72.14,48.37; IO33 69.6,48.37; IO34 66.2,48.37; IO35 63.66,48.37; IO36 61.12,48.37; IO37 58.58,48.37; IO38 56.04,48.37; IO39 53.5,48.37; IO40 50.96,48.37; IO41 48.42,48.37; IOREF 54.84,2.5; N/C 70.08,5.04; N/C1 52.3,2.5; P$1 10.26,51.27; P$2 10.26,53.81; P$3 10.26,56.35; RST 57.38,2.5; SCL 43.34,50.91; SDA 45.88,50.91; V_N 65,5.04; V_P 62.46,5.04; VIN 70.08,2.5; XGND 67.54,5.04 | drill 0.635 pad 1.016 square: GND3 93.56,56.47 | hole 3.17: 3.5,3.5; 3.5,53.86; 98.05,3.5; 98.05,53.86
XT60 = drill 5 octagon: + 4.5,0; - 11.5,0
U.FL = smd 2.2 x 0.85: P$1 0,1.375; P$2 0,-1.375 | smd 1.05 x 1: P$3 1.525,0; P$4 -1.525,0

### Placement (x,y rotation side)
B1  90.3,124.46 180 bottom
C11  192.92,156.46 180 top  (outside the outline)
C12  -74.8,110.49 180 top  (outside the outline)
C13  192.92,155.19 180 top  (outside the outline)
C14  189.62,148.08 90 top  (outside the outline)
C15  -74.54,85.09 180 top  (outside the outline)
C16  226.45,136.4 90 top  (outside the outline)
C17  193.17,166.37 180 top  (outside the outline)
C18  -74.29,60.2 180 top  (outside the outline)
C19  189.62,135.13 90 top  (outside the outline)
C20  226.45,124.46 90 top  (outside the outline)
C21  192.92,152.65 180 top  (outside the outline)
C22  192.92,153.92 180 top  (outside the outline)
C23  189.62,161.04 90 top  (outside the outline)
C24  226.45,162.05 90 top  (outside the outline)
C25  192.92,140.21 180 top  (outside the outline)
C26  189.87,95 90 top  (outside the outline)
C27  226.45,149.86 90 top  (outside the outline)
C28  193.17,126.75 180 top  (outside the outline)
C29  189.62,121.67 90 top  (outside the outline)
C30  226.45,110.49 90 top  (outside the outline)
C31  192.92,113.79 180 top  (outside the outline)
C32  189.62,108.97 90 top  (outside the outline)
C33  226.45,97.03 90 top  (outside the outline)
C34  192.92,100.08 180 top  (outside the outline)
C35  38.23,196.85 90 top  (outside the outline)
C36  10µF  [0603']  138.56,-17.78 270 top  (outside the outline)
C37  10µF  [0603']  131.96,-17.78 270 top  (outside the outline)
C38  0.1µF  [0603']  140.09,-17.78 270 top  (outside the outline)
C39  10µF  [0603']  55.25,148.59 180 top  (outside the outline)
C40  10µF  [0603']  98.18,149.35 0 top  (outside the outline)
C41  0.22uF  [0603']  107.07,142.75 0 top  (outside the outline)
C42  10uF  [0603']  107.07,141.22 0 top  (outside the outline)
D3  157.74,28.83 90 top
D4  153.42,28.83 90 top
D5  149.1,28.83 90 top
D6  144.79,28.83 90 top
D7  144.79,21.46 90 top
D8  149.1,21.46 90 top
D9  153.42,21.46 90 top
D10  157.74,21.46 90 top
D11  132.34,21.72 90 top
D12  128.02,21.72 90 top
D13  123.7,21.72 90 top
D14  119.39,21.72 90 top
D15  132.34,29.08 90 top
D16  128.02,29.08 90 top
D17  123.7,29.08 90 top
D18  119.39,28.83 90 top
D19  196.98,135.13 270 top  (outside the outline)
D20  196.98,121.67 270 top  (outside the outline)
D21  -99.18,52.83 0 top  (outside the outline)
D22  -99.18,56.9 0 top  (outside the outline)
D23  -99.18,60.96 0 top  (outside the outline)
D24  -99.18,65.02 0 top  (outside the outline)
D25  -92.07,52.83 0 top  (outside the outline)
D26  -92.07,56.9 0 top  (outside the outline)
D27  -92.07,60.96 0 top  (outside the outline)
D28  -92.07,65.02 0 top  (outside the outline)
D29  196.73,160.78 270 top  (outside the outline)
D30  196.73,148.08 270 top  (outside the outline)
D31  196.98,108.71 270 top  (outside the outline)
D32  196.98,95 270 top  (outside the outline)
D33  138.82,-29.72 0 top  (outside the outline)
D34  138.82,-20.83 180 top  (outside the outline)
D35  98.18,141.22 0 top  (outside the outline)
D36  98.18,142.75 0 top  (outside the outline)
D37  98.43,138.43 0 top  (outside the outline)
FB1  [0603']  137.04,-17.78 90 top  (outside the outline)
H1  169.17,4.19 0 top
H2  168.66,125.86 0 top
H3  5.47,125.86 0 top
H4  5.97,4.19 0 top
IC1  -10.66,-41.91 0 top  (outside the outline)
IC2  -85.97,83.82 90 top  (outside the outline)
IC4  -86.23,109.22 90 top  (outside the outline)
IC5  107.32,174.24 270 top  (outside the outline)
IC6  107.32,167.13 270 top  (outside the outline)
IC7  208.67,134.87 270 bottom  (outside the outline)
IC8  208.67,121.67 270 bottom  (outside the outline)
IC9  -85.97,58.93 90 top  (outside the outline)
IC10  107.32,160.02 270 top  (outside the outline)
IC11  208.67,160.53 270 bottom  (outside the outline)
IC12  208.67,148.08 270 bottom  (outside the outline)
IC13  208.67,108.46 270 bottom  (outside the outline)
IC14  208.67,95.25 270 bottom  (outside the outline)
IC15  46.87,182.37 0 bottom  (outside the outline)
IC16  102.75,141.73 270 top  (outside the outline)
J1  -88.13,122.68 180 top  (outside the outline)
J2  57.92,191.52 270 top  (outside the outline)
J3  -104.9,-139.45 0 top  (outside the outline)
J19  96.14,-23.11 0 top  (outside the outline)
J20  96.14,-25.65 0 top  (outside the outline)
J21  96.14,-28.19 0 top  (outside the outline)
J22  96.14,-30.73 0 top  (outside the outline)
J23  78.36,197.87 0 top  (outside the outline)
J24  78.36,200.41 0 top  (outside the outline)
J25  75.82,195.33 180 top  (outside the outline)
J26  58.04,200.41 0 top  (outside the outline)
J27  58.04,197.87 0 top  (outside the outline)
J28  96.14,195.07 180 top  (outside the outline)
J29  71.76,-30.73 0 top  (outside the outline)
L1  207.4,134.37 90 top  (outside the outline)
L2  207.65,121.16 90 top  (outside the outline)
L3  207.4,160.53 90 top  (outside the outline)
L4  207.4,147.57 90 top  (outside the outline)
L5  207.65,108.2 90 top  (outside the outline)
L6  207.65,94.49 90 top  (outside the outline)
LED5  138.82,-22.86 90 top  (outside the outline)
MC1_MOTORA  160.03,13.59 180 top
MC1_MOTORB  147.33,13.59 180 top
MC2_MOTORA  134.63,13.84 180 top
MC2_MOTORB  121.93,13.84 180 top
MC3_MOTORA  -105.79,49.78 90 top  (outside the outline)
MC3_MOTORB  -105.79,61.98 90 top  (outside the outline)
NRF8001  45.34,-30.73 0 top  (outside the outline)
PWMS1_GND  232.29,159.51 90 top  (outside the outline)
PWMS1_SIG  237.37,159.51 90 top  (outside the outline)
PWMS1_SUP  234.83,159.51 90 top  (outside the outline)
PWMS2_GND  232.29,147.07 90 top  (outside the outline)
PWMS2_SIG  237.37,147.07 90 top  (outside the outline)
PWMS2_SUP  234.83,147.07 90 top  (outside the outline)
PWMS3_GND  232.29,133.86 90 top  (outside the outline)
PWMS3_SIG  237.37,133.86 90 top  (outside the outline)
PWMS3_SUP  234.83,133.86 90 top  (outside the outline)
PWMS4_GND  232.29,121.92 90 top  (outside the outline)
PWMS4_SIG  237.37,121.92 90 top  (outside the outline)
PWMS4_SUP  234.83,121.92 90 top  (outside the outline)
PWMS5_GND  232.29,107.95 90 top  (outside the outline)
PWMS5_SIG  237.37,107.95 90 top  (outside the outline)
PWMS5_SUP  234.83,107.95 90 top  (outside the outline)
PWMS6_GND  232.29,94.49 90 top  (outside the outline)
PWMS6_SIG  237.37,94.49 90 top  (outside the outline)
PWMS6_SUP  234.83,94.49 90 top  (outside the outline)
Q3  101.99,149.61 0 top  (outside the outline)
Q4  105.54,149.61 0 top  (outside the outline)
R10  217.81,135.13 270 top  (outside the outline)
R11  219.08,129.29 180 top  (outside the outline)
R12  217.81,123.19 270 top  (outside the outline)
R13  219.08,117.35 180 top  (outside the outline)
R14  217.81,162.05 270 top  (outside the outline)
R15  219.08,156.21 180 top  (outside the outline)
R16  217.81,148.34 270 top  (outside the outline)
R17  219.08,142.49 180 top  (outside the outline)
R18  217.81,109.22 270 top  (outside the outline)
R19  219.33,103.38 180 top  (outside the outline)
R20  217.81,95.25 270 top  (outside the outline)
R21  219.08,89.41 180 top  (outside the outline)
R22  229.75,143.76 90 top  (outside the outline)
R23  229.75,104.39 90 top  (outside the outline)
R24  229.75,156.21 90 top  (outside the outline)
R25  229.75,118.36 90 top  (outside the outline)
R26  223.14,118.87 270 top  (outside the outline)
R27  34.93,197.36 270 top  (outside the outline)
R28  -76.58,124.21 270 bottom  (outside the outline)
R29  -76.58,131.32 270 bottom  (outside the outline)
R30  63.25,171.83 180 top  (outside the outline)
R31  10k  [0603']  138.82,-31.5 180 top  (outside the outline)
R32  10k  [0603']  130.43,-17.78 270 top  (outside the outline)
R33  1k  [0603']  138.82,-24.64 0 top  (outside the outline)
R34  126.37,-20.32 180 top  (outside the outline)
R36  10K  [0603']  105.29,145.03 0 top  (outside the outline)
R37  10K  [0603']  109.35,138.18 270 top  (outside the outline)
R38  10K  [0603']  108.34,148.34 90 top  (outside the outline)
R39  10K  [0603']  107.32,153.67 90 top  (outside the outline)
R40  10K  [0603']  102.75,138.43 0 top  (outside the outline)
R41  10K  [0603']  97.16,145.8 270 top  (outside the outline)
R42  10K  [0603']  98.68,145.8 270 top  (outside the outline)
R43  10K  [0603']  101.99,145.8 270 top  (outside the outline)
R44  10K  [0603']  100.21,145.8 270 top  (outside the outline)
S2  122.05,-26.92 90 top  (outside the outline)
SG1  130.69,-26.92 0 top  (outside the outline)
STEPDRV2  -101.59,-115.06 0 top  (outside the outline)
U2  226.19,130.56 180 bottom  (outside the outline)
U3  47.63,187.96 0 top  (outside the outline)
U4  150.25,-23.11 0 top  (outside the outline)
U5  134.5,-17.53 180 top  (outside the outline)
U8  106.3,137.92 180 top  (outside the outline)
U$1  107.96,121.92 270 top
U$14  113.67,197.87 180 top  (outside the outline)
U$55  162.44,-24.64 180 top  (outside the outline)

### Tracks (layer width: path | path; a pad name or v marks a point on that pad's centre or on a via)
5.0V  (1 unrouted)
ADC0  (1 unrouted)
ADC1  (1 unrouted)
ADC2  (1 unrouted)
ADC3  (1 unrouted)
ADC4  (1 unrouted)
ADC5  (1 unrouted)
ADC6  (1 unrouted)
ADC7  (1 unrouted)
ADC8  (1 unrouted)
ADC9  (1 unrouted)
ADC10  (1 unrouted)
ADC11  (1 unrouted)
AUX_D1  (1 unrouted)
C2  (1 unrouted)
CAP1  (1 unrouted)
CS_A/G  (2 unrouted)
CS_M  (2 unrouted)
DEN_3V  (2 unrouted)
ESP_ADC  (1 unrouted)
ESP_CH_PD  (2 unrouted)
ESP_GPIO0  (1 unrouted)
ESP_GPIO2  (1 unrouted)
ESP_GPIO4  (1 unrouted)
ESP_GPIO5  (1 unrouted)
ESP_GPIO12  (1 unrouted)
ESP_GPIO13  (1 unrouted)
ESP_GPIO14  (1 unrouted)
ESP_GPIO15  (2 unrouted)
ESP_GPIO16  (1 unrouted)
ESP_RESET  (3 unrouted)
ESP_VCC  (4 unrouted)
FIX  (1 unrouted)
GND  (155 unrouted)
  pour Top: 0.51,0 0.01,130.3 174.12,130.3 174.63,0
GPS_RX  (1 unrouted)
GPS_TX  (1 unrouted)
MCONTROLR1_INP1  (1 unrouted)
MCONTROLR1_INP2  (1 unrouted)
MCONTROLR1_INP3  (1 unrouted)
MCONTROLR1_INP4  (1 unrouted)
MCONTROLR2_INP1  (1 unrouted)
MCONTROLR2_INP2  (1 unrouted)
MCONTROLR2_INP3  (1 unrouted)
MCONTROLR2_INP4  (1 unrouted)
MCONTROLR3_INP1  (1 unrouted)
MCONTROLR3_INP2  (1 unrouted)
MCONTROLR3_INP3  (1 unrouted)
MCONTROLR3_INP4  (1 unrouted)
MOTOR1_PWM_A  (1 unrouted)
MOTOR1_PWM_B  (1 unrouted)
MOTOR2_PWM_A  (1 unrouted)
MOTOR2_PWM_B  (1 unrouted)
MOTOR3_PWM_A  (1 unrouted)
MOTOR3_PWM_B  (1 unrouted)
N$1  (1 unrouted)
N$5  (1 unrouted)
N$13  (1 unrouted)
N$14  (1 unrouted)
N$15  (2 unrouted)
N$16  (2 unrouted)
N$17  (2 unrouted)
N$18  (1 unrouted)
N$27  (3 unrouted)
N$32  (2 unrouted)
N$33  (3 unrouted)
N$34  (3 unrouted)
N$35  (3 unrouted)
N$36  (3 unrouted)
N$37  (3 unrouted)
N$38  (3 unrouted)
N$39  (3 unrouted)
N$40  (3 unrouted)
N$41  (3 unrouted)
N$42  (2 unrouted)
N$43  (2 unrouted)
N$44  (3 unrouted)
N$45  (2 unrouted)
N$46  (3 unrouted)
N$47  (3 unrouted)
N$48  (3 unrouted)
N$49  (3 unrouted)
N$50  (3 unrouted)
N$51  (2 unrouted)
N$52  (3 unrouted)
N$53  (2 unrouted)
N$54  (3 unrouted)
N$55  (1 unrouted)
N$57  (1 unrouted)
N$58  (1 unrouted)
N$59  (1 unrouted)
N$60  (1 unrouted)
N$61  (1 unrouted)
N$62  (1 unrouted)
N$63  (1 unrouted)
N$64  (1 unrouted)
N$65  (1 unrouted)
N$66  (1 unrouted)
N$67  (1 unrouted)
N$68  (1 unrouted)
N$69  (1 unrouted)
N$70  (1 unrouted)
N$71  (1 unrouted)
N$73  (1 unrouted)
N$75  (2 unrouted)
N$77  (4 unrouted)
N$78  (2 unrouted)
N$79  (1 unrouted)
N$80  (2 unrouted)
N$81  (1 unrouted)
N$82  (1 unrouted)
OE  (1 unrouted)
OUT  (1 unrouted)
PWM0  (1 unrouted)
PWM1  (1 unrouted)
PWM2  (1 unrouted)
PWM3  (1 unrouted)
PWM4  (1 unrouted)
PWM5  (1 unrouted)
PWM6  (1 unrouted)
PWM7  (1 unrouted)
PWM8  (1 unrouted)
PWM9  (1 unrouted)
PWM10  (1 unrouted)
PWM11  (1 unrouted)
PWM12  (1 unrouted)
PWM13  (1 unrouted)
PWM14  (1 unrouted)
PWM15  (1 unrouted)
SCL  (3 unrouted)
SCL_3V  (2 unrouted)
SDA  (3 unrouted)
SDA_3V  (2 unrouted)
SDO_AG  (1 unrouted)
SDO_M  (1 unrouted)
SW_MODE_SUPPLY1  (5 unrouted)
SW_MODE_SUPPLY2  (5 unrouted)
SW_MODE_SUPPLY3  (5 unrouted)
SW_MODE_SUPPLY4  (5 unrouted)
SW_MODE_SUPPLY5  (5 unrouted)
SW_MODE_SUPPLY6  (5 unrouted)
UC_5V  (29 unrouted)
VBACKUP  (1 unrouted)
VDD  (14 unrouted)
VIN  (40 unrouted)
  pour Bottom: 0.51,0 0.01,130.3 174.12,130.3 174.63,0
WIFI_RX  (1 unrouted)
WIFI_TX  (1 unrouted)

### Text on the board
tPlace: ADC | ESP_TX | ESP_RX | ESP_GPIO4 | ESP_GPIO5 | ESP_GPIO0 | ESP_GPIO2 | ESP_GPIO15 | ESP_GND | ESP_RESET | ESP_ADC | ESP_CH_PD | ESP_GPIO16 | ESP_GPIO14 | ESP_GPIO12 | ESP_GPIO13 | ESP_VCC
tDocu: GND | 5V | 0 | 1 | 2 | 3 | 4 | 5 | 6 | 7 | 8 | 9 | 10 | 11 | 12 | 13 | 14 | 15 | Electromechanical Development Board | v2.0 | University of Texas at Austin IOT Lab | 0 | 1 | 2 | 3 | 4 | 5 | 6 | 7 | 8 | 9 | 10 | 11 | 12 | 13 | 14 | 15 | 16 | 17 | Ultrasonic Headers | D38, D39 | D40, D41(BUZZER) | SCK | MISO | MOSI | REQ | RDY | D9 | RST | NC | GND | 5V | D53 | D12 | D13 | D17/RX2 | D16/TX2 | D49 | D48 | D47 | D46 | D42, D43 | D44, D45